# Altium project STM32_Battery_Management_System.PrjPcb (part 1 of 2)
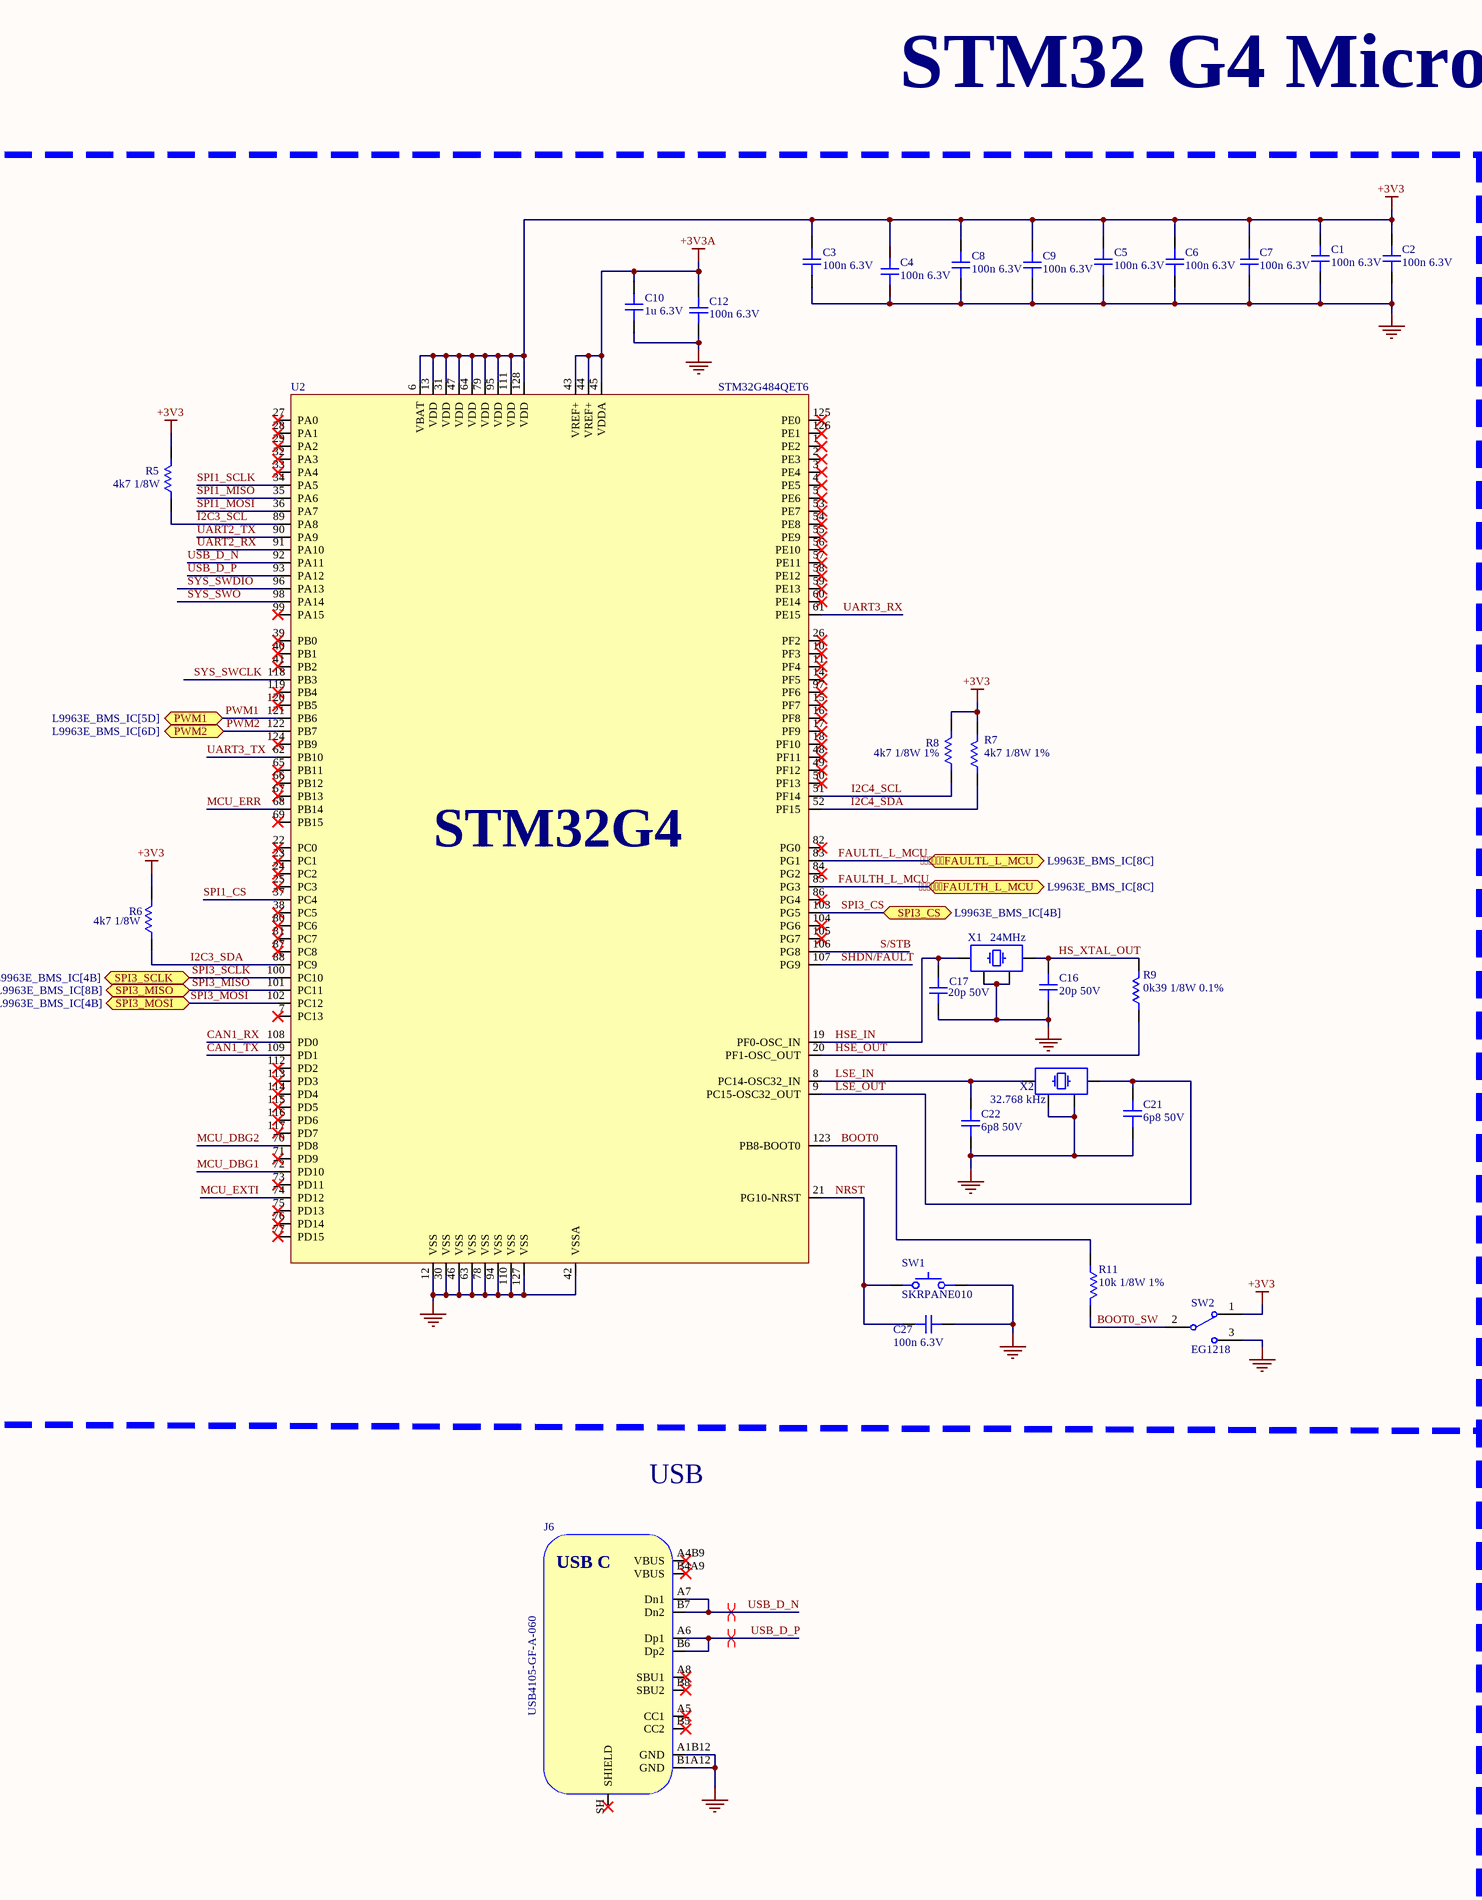
[diagram p0: Microcontroller.SchDoc, left]
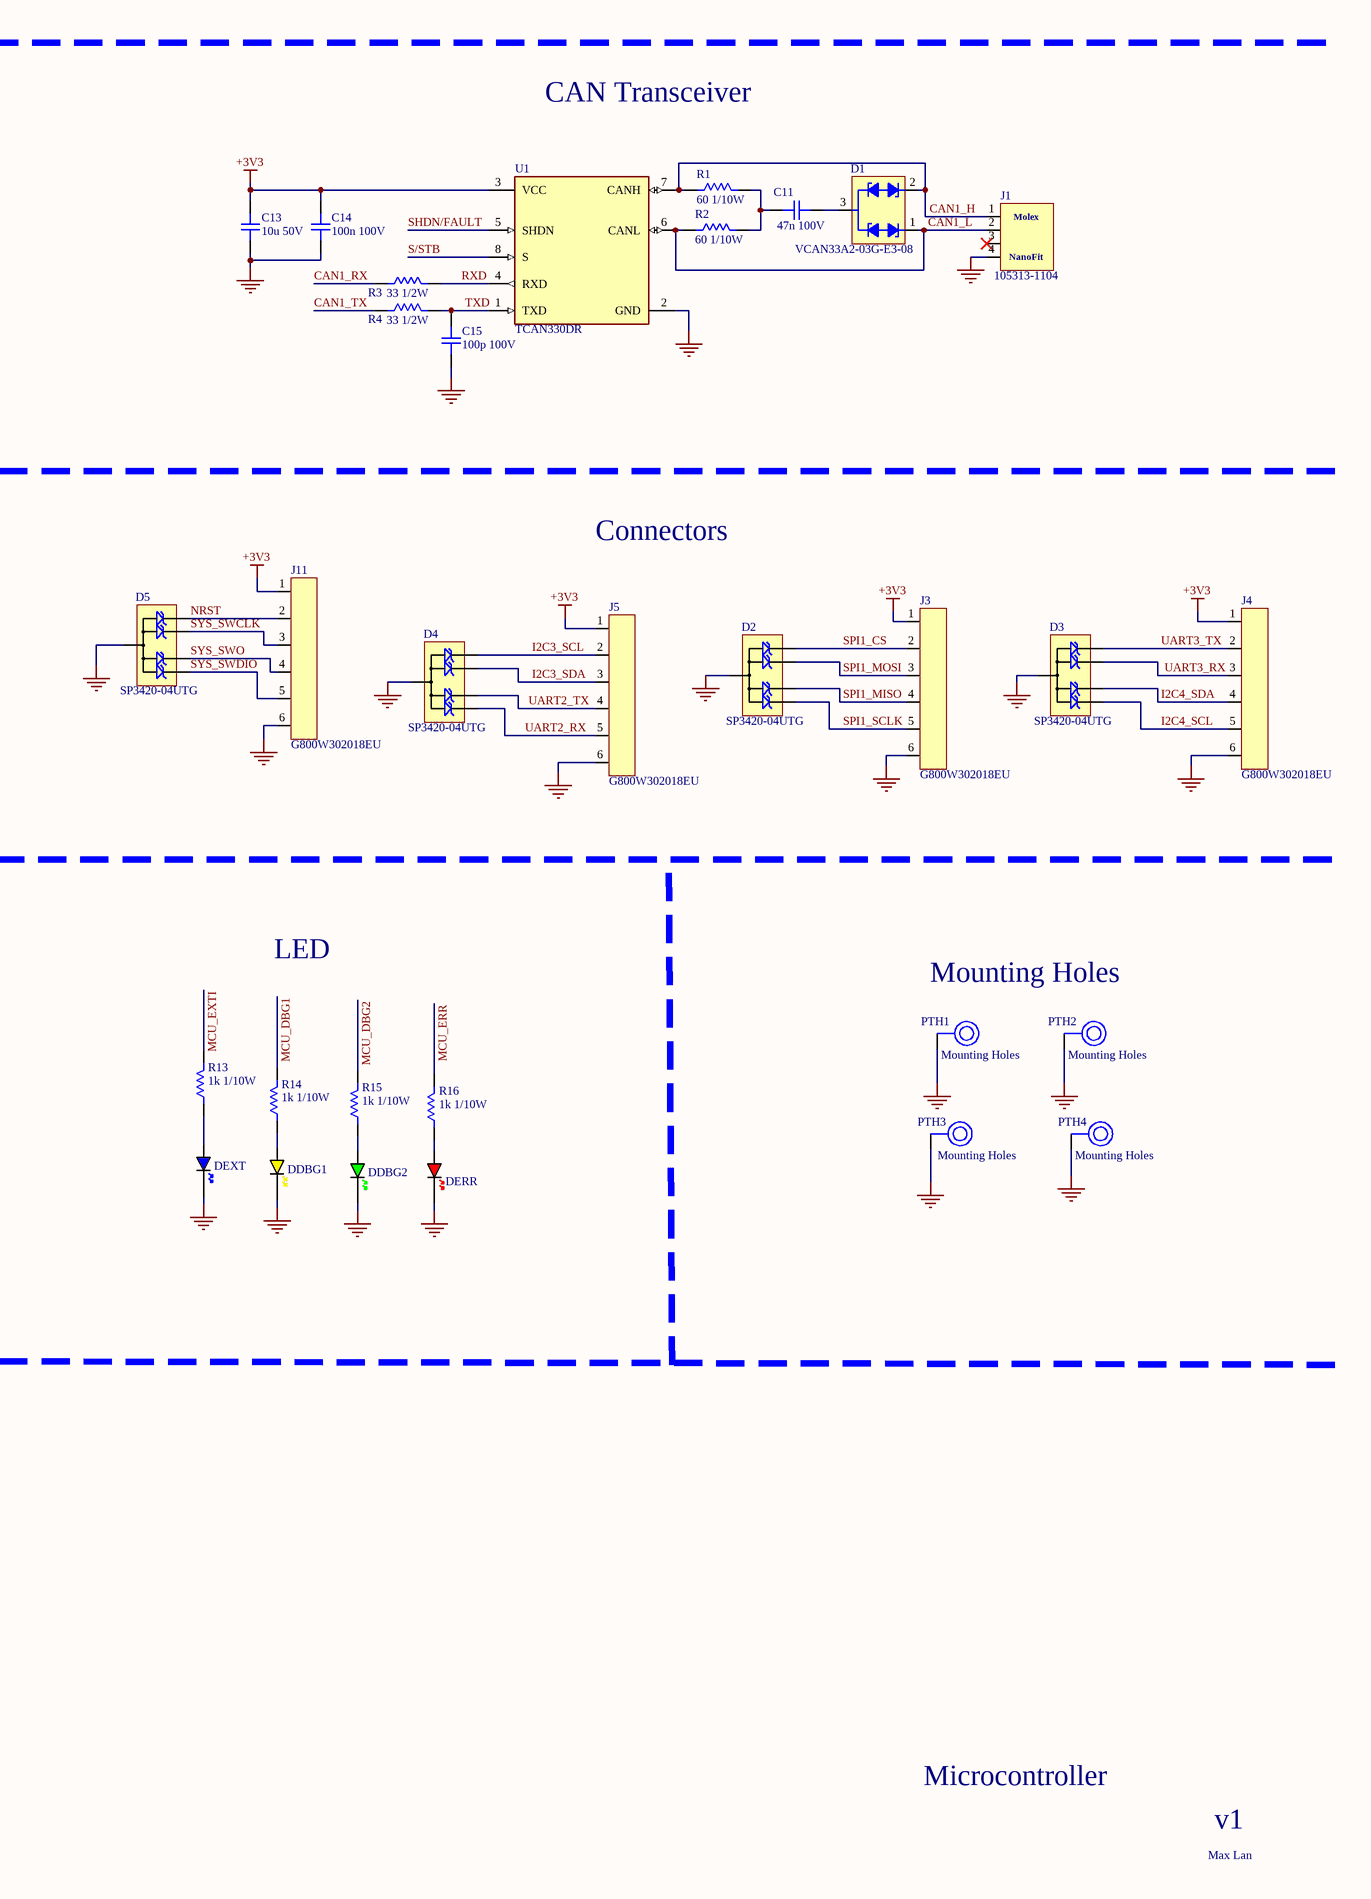
[diagram p1: Microcontroller.SchDoc, right]
4 sheets, 237 parts. Net scope: flat (ports and power ports of the same name join across sheets).
Board file: STM32_Battery_Management_System_V1.PcbDoc
Sheets:
  Microcontroller.SchDoc
  L9963E_BMS_IC.SchDoc
  Power_Management.SchDoc
  TopLevel.SchDoc

## Sheet Microcontroller.SchDoc
size A2; SheetNumber: 1; SheetTotal: 4

### Parts
C1  100n 6.3V  [CAP_0603]
C2  100n 6.3V  [CAP_0603]
C3  100n 6.3V  [CAP_0603]
C4  100n 6.3V  [CAP_0603]
C5  100n 6.3V  [CAP_0603]
C6  100n 6.3V  [CAP_0603]
C7  100n 6.3V  [CAP_0603]
C8  100n 6.3V  [CAP_0603]
C9  100n 6.3V  [CAP_0603]
C10  1u 6.3V  [CAP_0603]
C11  47n 100V  [CAP_0603]
C12  100n 6.3V  [CAP_0603]
C13  10u 50V  [CAP_1210]
C14  100n 100V  [CAP_0603]
C15  100p 100V  [CAP_0603]
C16  20p 50V  [CAP_0603]
C17  20p 50V  [CAP_0603]
C21  6p8 50V  [CAP_0603]
C22  6p8 50V  [CAP_0603]
C27  100n 6.3V  [CAP_0603]
D1  VCAN33A2-03G-E3-08  [VCAN33A2-03G-E3-08]
D2  SP3420-04UTG  [uDFN-10]
D3  SP3420-04UTG  [uDFN-10]
D4  SP3420-04UTG  [uDFN-10]
D5  SP3420-04UTG  [uDFN-10]
DDBG1  YELLOW  [LED_0603_YELLOW]  (value not drawn)
DDBG2  GREEN  [LED_0603_GREEN]  (value not drawn)
DERR  RED  [LED_0603_RED]  (value not drawn)
DEXT  BLUE  [LED_0603_BLUE]  (value not drawn)
J1  105313-1104  [105313-1104]
J3  G800W302018EU  [G800W302018EU]
J4  G800W302018EU  [G800W302018EU]
J5  G800W302018EU  [G800W302018EU]
J6  USB4105-GF-A-060  [USB4105-GF-A-060]
J11  G800W302018EU  [G800W302018EU]
PTH1  Mounting Holes  [Mounting Hole]
PTH2  Mounting Holes  [Mounting Hole]
PTH3  Mounting Holes  [Mounting Hole]
PTH4  Mounting Holes  [Mounting Hole]
R1  60 1/10W  [RES_0201]
R2  60 1/10W  [RES_0201]
R3  33 1/2W  [RES_1206]
R4  33 1/2W  [RES_1206]
R5  4k7 1/8W  [RES_0603]
R6  4k7 1/8W  [RES_0603]
R7  4k7 1/8W 1%  [RES_0603]
R8  4k7 1/8W 1%  [RES_0603]
R9  0k39 1/8W 0.1%  [RES_0603]
R11  10k 1/8W 1%  [RES_0603]
R13  1k 1/10W  [RES_0603]
R14  1k 1/10W  [RES_0603]
R15  1k 1/10W  [RES_0603]
R16  1k 1/10W  [RES_0603]
SW1  SKRPANE010  [SKRPANE010]
SW2  EG1218  [ESWI-EG1218_V]
U1  TCAN330DR  [FP-D0008A-IPC_A]
U2  STM32G484QET6  [LQFP-128]
X1  24MHz  [XTAL_3225]
X2  32.768 kHz  [G43270009]

### Ports
FAULTH_L_MCU (bidir, see L9963E_BMS_IC[8C]), FAULTL_L_MCU (bidir, see L9963E_BMS_IC[8C]), PWM1 (bidir, see L9963E_BMS_IC[5D]), PWM2 (bidir, see L9963E_BMS_IC[6D]), SPI3_CS (bidir, see L9963E_BMS_IC[4B]), SPI3_MISO (bidir, see L9963E_BMS_IC[8B]), SPI3_MOSI (bidir, see L9963E_BMS_IC[4B]), SPI3_SCLK (bidir, see L9963E_BMS_IC[4B])

### Nets
+3V3: C1.2 C2.2 C3.2 C4.2 C5.2 C6.2 C7.2 C8.2 C9.2 C13.2 C14.2 J3.1 J4.1 J5.1 J11.1 R5.2 R6.2 R7.2 R8.2 SW2.1 U1.3(VCC) U2.6(VBAT) U2.13(VDD) U2.31(VDD) U2.47(VDD) U2.64(VDD) U2.79(VDD) U2.95(VDD) U2.111(VDD) U2.128(VDD)
+3V3A: C10.2 C12.2 U2.43(VREF+) U2.44(VREF+) U2.45(VDDA)
GND: C1.1 C2.1 C3.1 C4.1 C5.1 C6.1 C7.1 C8.1 C9.1 C10.1 C12.1 C13.1 C14.1 C15.1 C16.1 C17.1 C21.2 C22.1 C27.1 D2.38(GND) D3.38(GND) D4.38(GND) D5.38(GND) DDBG1.K DDBG2.K DERR.K DEXT.K J1.4 J3.6 J4.6 J5.6 J6.A1B12(GND) J6.B1A12(GND) J11.6 PTH1.1 PTH2.1 PTH3.1 PTH4.1 SW1.34 SW2.3 U1.2(GND) U2.12(VSS) U2.30(VSS) U2.42(VSSA) U2.46(VSS) U2.63(VSS) U2.78(VSS) U2.94(VSS) U2.110(VSS) U2.127(VSS) X1.2 X1.4 X2.2 X2.4
BOOT0: R11.1 U2.123(PB8-BOOT0)
BOOT0_SW: R11.2 SW2.2(COM)
CAN1_H: D1.2 J1.1 R1.1 U1.7(CANH)
CAN1_L: D1.1 J1.2 R2.1 U1.6(CANL)
CAN1_RX: R3.1 U2.108(PD0)
CAN1_TX: R4.1 U2.109(PD1)
FAULTH_L_MCU: U2.85(PG3) ; port FAULTH_L_MCU
FAULTL_L_MCU: U2.83(PG1) ; port FAULTL_L_MCU
HS_XTAL_OUT: C16.2 R9.2 X1.3
HSE_IN: C17.2 U2.19(PF0-OSC_IN) X1.1
HSE_OUT: R9.1 U2.20(PF1-OSC_OUT)
I2C3_SCL: D4.110 J5.2 R5.1 U2.89(PA8)
I2C3_SDA: D4.29 J5.3 R6.1 U2.88(PC9)
I2C4_SCL: D3.56 J4.5 R8.1 U2.51(PF14)
I2C4_SDA: D3.47 J4.4 R7.1 U2.52(PF15)
LSE_IN: C22.2 U2.8(PC14-OSC32_IN) X2.1
LSE_OUT: C21.1 U2.9(PC15-OSC32_OUT) X2.3
MCU_DBG1: R14.2 U2.72(PD10)
MCU_DBG2: R15.2 U2.70(PD8)
MCU_ERR: R16.2 U2.68(PB14)
MCU_EXTI: R13.2 U2.74(PD12)
NRST: C27.2 D5.110 J11.2 SW1.12 U2.21(PG10-NRST)
PWM1: U2.121(PB6) ; port PWM1
PWM2: U2.122(PB7) ; port PWM2
RXD: R3.2 U1.4(RXD)
S/STB: U1.8(S) U2.106(PG8)
SHDN/FAULT: U1.5(SHDN) U2.107(PG9)
SPI1_CS: D2.110 J3.2 U2.37(PC4)
SPI1_MISO: D2.47 J3.4 U2.35(PA6)
SPI1_MOSI: D2.29 J3.3 U2.36(PA7)
SPI1_SCLK: D2.56 J3.5 U2.34(PA5)
SPI3_CS: U2.103(PG5) ; port SPI3_CS
SPI3_MISO: U2.101(PC11) ; port SPI3_MISO
SPI3_MOSI: U2.102(PC12) ; port SPI3_MOSI
SPI3_SCLK: U2.100(PC10) ; port SPI3_SCLK
SYS_SWCLK: D5.29 J11.3 U2.118(PB3)
SYS_SWDIO: D5.56 J11.5 U2.96(PA13)
SYS_SWO: D5.47 J11.4 U2.98(PA14)
TXD: C15.2 R4.2 U1.1(TXD)
UART2_RX: D4.56 J5.5 U2.91(PA10)
UART2_TX: D4.47 J5.4 U2.90(PA9)
UART3_RX: D3.29 J4.3 U2.61(PE15)
UART3_TX: D3.110 J4.2 U2.62(PB10)
USB_D_N: J6.A7(Dn1) J6.B7(Dn2) U2.92(PA11)
USB_D_P: J6.A6(Dp1) J6.B6(Dp2) U2.93(PA12)
NetC11_1: C11.1 R1.2 R2.2
NetC11_2: C11.2 D1.3
NetDDBG1_A: DDBG1.A R14.1
NetDDBG2_A: DDBG2.A R15.1
NetDERR_A: DERR.A R16.1
NetDEXT_A: DEXT.A R13.1

Not connected (* = marked no-connect by the designer): J1 3*; J6 A4B9(VBUS)* A5(CC1)* A8(SBU1)* B4A9(VBUS)* B5(CC2)* B8(SBU2)* SH(SHIELD)*; U2 1(PE2)* 2(PE3)* 3(PE4)* 4(PE5)* 5(PE6)* 7(PC13)* 10(PF3)* 11(PF4)* 14(PF5)* 15(PF7)* 16(PF8)* 17(PF9)* 18(PF10)* 22(PC0)* 23(PC1)* 24(PC2)* 25(PC3)* 26(PF2)* 27(PA0)* 28(PA1)* 29(PA2)* 32(PA3)* 33(PA4)* 38(PC5)* 39(PB0)* 40(PB1)* 41(PB2)* 48(PF11)* 49(PF12)* 50(PF13)* 53(PE7)* 54(PE8)* 55(PE9)* 56(PE10)* 57(PE11)* 58(PE12)* 59(PE13)* 60(PE14)* 65(PB11)* 66(PB12)* 67(PB13)* 69(PB15)* 71(PD9)* 73(PD11)* 75(PD13)* 76(PD14)* 77(PD15)* 80(PC6)* 81(PC7)* 82(PG0)* 84(PG2)* 86(PG4)* 87(PC8)* 97(PF6)* 99(PA15)* 104(PG6)* 105(PG7)* 112(PD2)* 113(PD3)* 114(PD4)* 115(PD5)* 116(PD6)* 117(PD7)* 119(PB4)* 120(PB5)* 124(PB9)* 125(PE0)* 126(PE1)*

### Layout directives
differential pair; differential pair class USB_DIFF_PAIR: USB_D_N, USB_D_P

### Notes on the sheet
- STM32 G4 Microcontroller
- CAN Transceiver
- Connectors
- LED
- Mounting Holes
- USB
- Microcontroller
- Max Lan
- v1
- (in symbol 105313-1104) NanoFit
- (in symbol STM32G484QET6) STM32G4
- (in symbol USB4105-GF-A-060) USB C

### Library data of the parts
C1-C9 C12 C27 = KGM15AR70J104KT: Multilayer Ceramic Capacitors MLCC - SMD/SMT 6.3V .1uF X7R 0603 10%; Manufacturer: KYOCERA AVX; Rating: 100n 6.3V 100n 0603; Manufacturer Part Number: KGM15AR70J104KT; Distributor Link: https://ele.kyocera.com/assets/products/capacitor/KGM_Series_e.pdf; LCSC: N/A; Dielectric: *
C10 = C0603X105K9RACAUTO: Multilayer Ceramic Capacitors MLCC - SMD/SMT 6.3 Vo 1 uF 0603 X7R 10 % AECQ200; Manufacturer: KEMET; Rating: 1u 6.3V X7R 0603; Manufacturer Part Number: C0603X105K9RACAUTO; Distributor Link: https://www.mouser.tw/datasheet/3/72/1/C0603X105K9RACAUTO.pdf; LCSC: N/A; Dielectric: *
C11 = C0603C473J1RACTU: Multilayer Ceramic Capacitors MLCC - SMD/SMT 100V 0.047uF X7R 0603 5%; Manufacturer: KEMET; Rating: 47nF 100V X7R 0603 5%; Manufacturer Part Number: C0603C473J1RACTU; Distributor Link: https://www.mouser.tw/en/ProductDetail/KEMET/C0603C473J1RACTU?qs=sGAEpiMZZMvsSlwiRhF8qpRMYGxmftL79YZ310PzB5U%3D; Datasheet Link: https://www.mouser.tw/datasheet/3/72/1/C0603C473J1RACTU.pdf; Dielectric: *
C13 = KAF32LR71H106KL: Multilayer Ceramic Capacitors MLCC - SMD/SMT 50V 10uF X7R 1210 10 % AEC-Q200 FLEXITERM; Manufacturer: KYOCERA AVX; Rating: 10uF 50V 1210 X7R 10%; Manufacturer Part Number: KAF32LR71H106KL; Distributor Link: https://www.mouser.tw/en/ProductDetail/KYOCERA-AVX/KAF32LR71H106KL?qs=sGAEpiMZZMsh%252B1woXyUXj17cMikWvs6%2F%252Bex2HAbQHVc%3D; Datasheet Link: https://www.mouser.tw/datasheet/3/5926/1/AutoMLCCKAF.pdf; Dielectric: *
C14 = MAJCH168BB7104KTEA01: Multilayer Ceramic Capacitors MLCC - SMD/SMT 100V 0.1uF 0603 X7R 10% AECQ2; Manufacturer: TAIYO YUDEN; Rating: 100nF 100V X7R 0603 10%; Manufacturer Part Number: MAJCH168BB7104KTEA01; Distributor Link: https://www.mouser.tw/en/ProductDetail/TAIYO-YUDEN/MAJCH168BB7104KTEA01?qs=ZcfC38r4PovaTBrG0IdezQ%3D%3D; Datasheet Link: https://www.mouser.com/catalog/specsheets/TAIYO_YUDEN_03-08-2024_MAJCH168BB7104KTEA01_SS.pdf?_gl=1*17qbpp1*_gcl_aw*R0NMLjE3ODUyMjg2NDkuQ2p3S0NBandwcUhUQmhBY0Vpd0FqMkFmdXJYOV9OUy1CV0xFSmd6T0FaYy1HZXR1bHVfaUZmaHVzRkI2bHhkODVUMjVSNlJWbnBOUkFob0NEdHNRQXZEX0J3RQ..*_gcl_au*MTM0NzYwMzc0Mi4xNzgyNDQ3MDMwLjE4MDQ0Nzg2ODUuMTc4NTI5MDg4OS4xNzg1MjkxOTE2LjE1NDk0Mzk5MTcuMTc4NTIxODYwOC4xNzg1MjkxOTE2*_ga*MTg5NTU5OTIyLjE3ODI0NDcwMzM.*_ga_15W4STQT4T*czE3ODUyODM3NTgkbzk5JGcxJHQxNzg1MjkxOTI1JGo0MiRsMCRoMA..; Dielectric: *
C15 = KGM15AR72A101JT: Multilayer Ceramic Capacitors MLCC - SMD/SMT 100V 100pF X7R 0603 5%; Manufacturer: KYOCERA AVX; Rating: 100pF 100V X7R 0603 5%; Manufacturer Part Number: KGM15AR72A101JT; Distributor Link: https://ele.kyocera.com/assets/products/capacitor/KGM_Series_e.pdf; Datasheet Link: https://www.mouser.tw/en/ProductDetail/KYOCERA-AVX/KGM15AR72A101JT?qs=sGAEpiMZZMvsSlwiRhF8qrQG6leidpLjMVa2%2F5XxVbDE2R%2F9vaQftg%3D%3D; Dielectric: *
C16 C17 = C0603C200J5RACTU: Multilayer Ceramic Capacitors MLCC - SMD/SMT 50V 20pF 5% X7R 0603; Manufacturer: KEMET; Rating: 20p 50V X7R 0603; Manufacturer Part Number: Multilayer Ceramic Capacitors MLCC - SMD/SMT 50V 20pF 5% X7R 0603; Distributor Link: https://www.mouser.tw/datasheet/3/72/1/KEM_C1002_X7R_SMD.pdf; LCSC: N/A; Dielectric: *
C21 C22 = 06035C6R8KAT2A: Multilayer Ceramic Capacitors MLCC - SMD/SMT T101 COMMERCIAL; Manufacturer: KYOCERA AVX; Rating: 6.8pF 50VDC X7R 10% 0603; Manufacturer Part Number: 06035C6R8KAT2A; Distributor Link: https://www.mouser.tw/datasheet/3/5926/1/X7RDielectric.pdf; LCSC: N/A; Dielectric: *
D1 = VCAN33A2-03G-E3-08: ESD Protection Diodes / TVS Diodes 9.5pF 33V SOT-323; Manufacturer Name: Vishay Semicondutors; ComponentLink1Description: Datasheet Link; ComponentLink1URL: https://www.vishay.com/doc?86152; ComponentLink2Description: Distributor Link; ComponentLink2URL: https://www.mouser.tw/en/ProductDetail/Vishay-Semiconductors/VCAN33A2-03G-E3-08?qs=wnTfsH77Xs51hWQib6XZOg%3D%3D; Ratings: 9.5pF 33V
D2-D5 = SP3420-04UTG: TVS Diode Array Low Capacitance ESD Protection 4-Channel (Vwork=3V3, Vclamp=6V); Manufacturer: Littelfuse; Manufacturer Part Number: SP3420-04UTG
DDBG1 = LED_0603_YELLOW: LED 0603 YELLOW SMD
DDBG2 = LED_0603_GREEN: LED 0603 GREEN SMD
DERR = LED_0603_RED: LED 0603 RED SMD
DEXT = LED_0603_BLUE: LED 0603 BLUE SMD
J1 = 105313-1104: Nano-Fit Right-Angle Header, Through Hole, 2.50mm Pitch, Single Row, 2 Circuits, Tin (Sn) Plating, Black, Glow-Wire Capable, Tray; Manufacturer: Molex; Manufacturer Part Number: 105313-1104
J3-J5 J11 = G800W302018EU: Pin Header 6 Position 2.54mm Pitch; Manufacturer: Amphenol; Manufacturer Part Number: G800W302018EU
J6 = USB4105-GF-A-060: USB Connector Type C SMT 12 Pin; Manufacturer: GCT; Manufacturer Part Number: USB4105-GF-A-060; Distributor Link: https://eu.mouser.com/ProductDetail/GCT/USB4105-GF-A-060?qs=QNEnbhJQKvY2mocwNJzgfA%3D%3D
PTH1-PTH4 = Mounting Holes: I'm so sick of having to manually make these everytime with a different size, and how in the world do do I make one like Phil's Lab with Gnd vias around it?
R1 R2 = RK73H1HRTTCM60R4F: Thick Film Resistors - SMD; Manufacturer: KOA Speer; Values: 60ohm 1/10W 1% 0201; Manufacturer Part Number: RK73H1HRTTCM60R4F; Distributor Link: https://www.mouser.tw/en/ProductDetail/KOA-Speer/RK73H1HRTTCM60R4F?qs=sGAEpiMZZMvdGkrng054t2cqbZCzJY7NpUeVphkOANR%252BH8AfE6cgtQ%3D%3D; Datasheet Link: https://www.koaspeer.com/pdfs/RK73-RT.pdf
R3 R4 = SR1206FR-7W33RL: Thick Film Resistors - SMD 33 Ohms 1/2 W 1206 1 % AEC-Q200; Manufacturer: YAGEO; Values: 33ohm 1/2W 1205 1%; Manufacturer Part Number: SR1206FR-7W33RL; Distributor Link: https://www.mouser.tw/en/ProductDetail/YAGEO/SR1206FR-7W33RL?qs=1mbolxNpo8dtzpgXLPcQnA%3D%3D; Datasheet Link: https://www.mouser.tw/datasheet/3/508/1/PYu-SR_20105_RoHS_L_12.pdf
R5-R8 = CRCW06034K70FKEA: Thick Film Resistors - SMD 1/8 Watt 4.7Kohms 1%; Manufacturer: Vishay; Values: 4.7k 1% 1/8W 0603; Manufacturer Part Number: CRCW06034K70FKEA; Distributor Link: https://www.vishay.com/docs/20035/dcrcwe3.pdf
R9 = ERA-3VEB3900V: Thin Film Resistors - SMD 0603 0.1% 390ohm 25ppm SMD; Manufacturer: Panasonic; Ratings: 390ohm 0603 0.1% 1/8W; Manufacturer Part Number: ERA-3VEB3900V; Distributor Link: https://industrial.panasonic.com/cdbs/www-data/pdf/RDM0000/RDM0000C331.pdf; LCSC: N/A
R11 = CRCW060310K0FKEI: Thick Film Resistors - SMD 10K OHM 1%; Manufacturer: Vishay; Value: 10k 1% 1/8W 0603; Manufacturer Part Number: CRCW060310K0FKEI; Distributor Link: https://www.vishay.com/docs/20035/dcrcwe3.pdf
R13-R16 = CR0603-FX-1001EPF: Thick Film Resistors - SMD Res 0603 1k 1% 100mW TC100 low lead; Manufacturer: Bourns; Values: 1k 1% 1/10W 0603; Manufacturer Part Number: CR0603-FX-1001EPF; Distributor Link: https://www.mouser.tw/en/ProductDetail/Bourns/CR0603-FX-1001EPF?qs=sGAEpiMZZMvdGkrng054t2cqbZCzJY7NyLPI0qsjVVoXr8t57oNyzw%3D%3D; Datasheet Link: https://www.mouser.tw/datasheet/3/40/1/CR-PF.pdf
SW1 = SKRPANE010: Tactile Switch SMD SPST; Manufacturer: Alps Alpine; Manufacturer Part Number: SKRPANE010
SW2 = CMP-1696-00002-1: Slide Switch, 500 V, -20 to 70 degC, 3-Pin THD, RoHS; Case\Package: SOT-23-5; Output Current: 150 mA; Nominal Output Voltage: 3.3 V; Max Power Dissipation: 250 mW; Min Input Voltage: 4.3 V; Outputs: 1; Max Input Voltage: 8 V; Dropout Voltage: 300 mV; PackageDescription: 3-Pin Through Hole Device, Body 11.6 x 4 mm, Pitch 2.5 mm; ComponentLink1URL: http://www.e-switch.ch/en/; RoHSCompliant: true; Length: 3 mm; ComponentLink1Description: Manufacturer URL; Power Rating: 250 mW; Mount: Surface Mount; Max Operating Temperature: 85 degC; REACH SVHC: No SVHC; Radiation Hardening: No; Height: 1.3 mm; Pins: 5; Max Ouput Current: 150 mA; Output Voltage: 3.3 V; Width: 1.8 mm; Package Quantity: 3000; ComponentLink2URL: https://www.e-switch.com/system/asset/product_line/data_sheet/119/EG.pdf; Min Operating Temperature: -40 degC; ComponentLink2Description: Datasheet; DatasheetVersion: Oct-15; PackageReference: EG1218; Packaging: Tape and Reel
U1 = CMP-04872-000104-1: IC TRANSCEIVER 1/1 8SOIC; Data Rate: 1Mbps; RoHS Compliant: Yes; Case/Package: SOIC; Mount: Surface Mount; Number of Pins: 8; Packaging: Cut Tape; Max Operating Temperature: 125°C; Lead Free: Lead Free; Min Operating Temperature: -40°C
U2 = STM32G484QET6: STM32G4 Microcontroller LQFP-128 170 MHz 107 I/O; Manufacturer: STMicroelectronics; Manufacturer Part Number: STM32G484QET6
X1 = TSX-3225_24.0000MF15X-AC: Crystal SMD 24MHz 10PPM 7pF 3225; Manufacturer: Epson; Manufacturer Part Number: TSX-3225 24.0000MF15X-AC
X2 = G43270009: Crystals Crystal Plastic SMD8038 T&R 3K. / 32.768 kHz; Load Capacitance: 8pF; Tolerance: 10 PPM; Distributor Link: *; Frequency: 32.768 kHz

## Sheet L9963E_BMS_IC.SchDoc
size A2; SheetNumber: 2; SheetTotal: 4
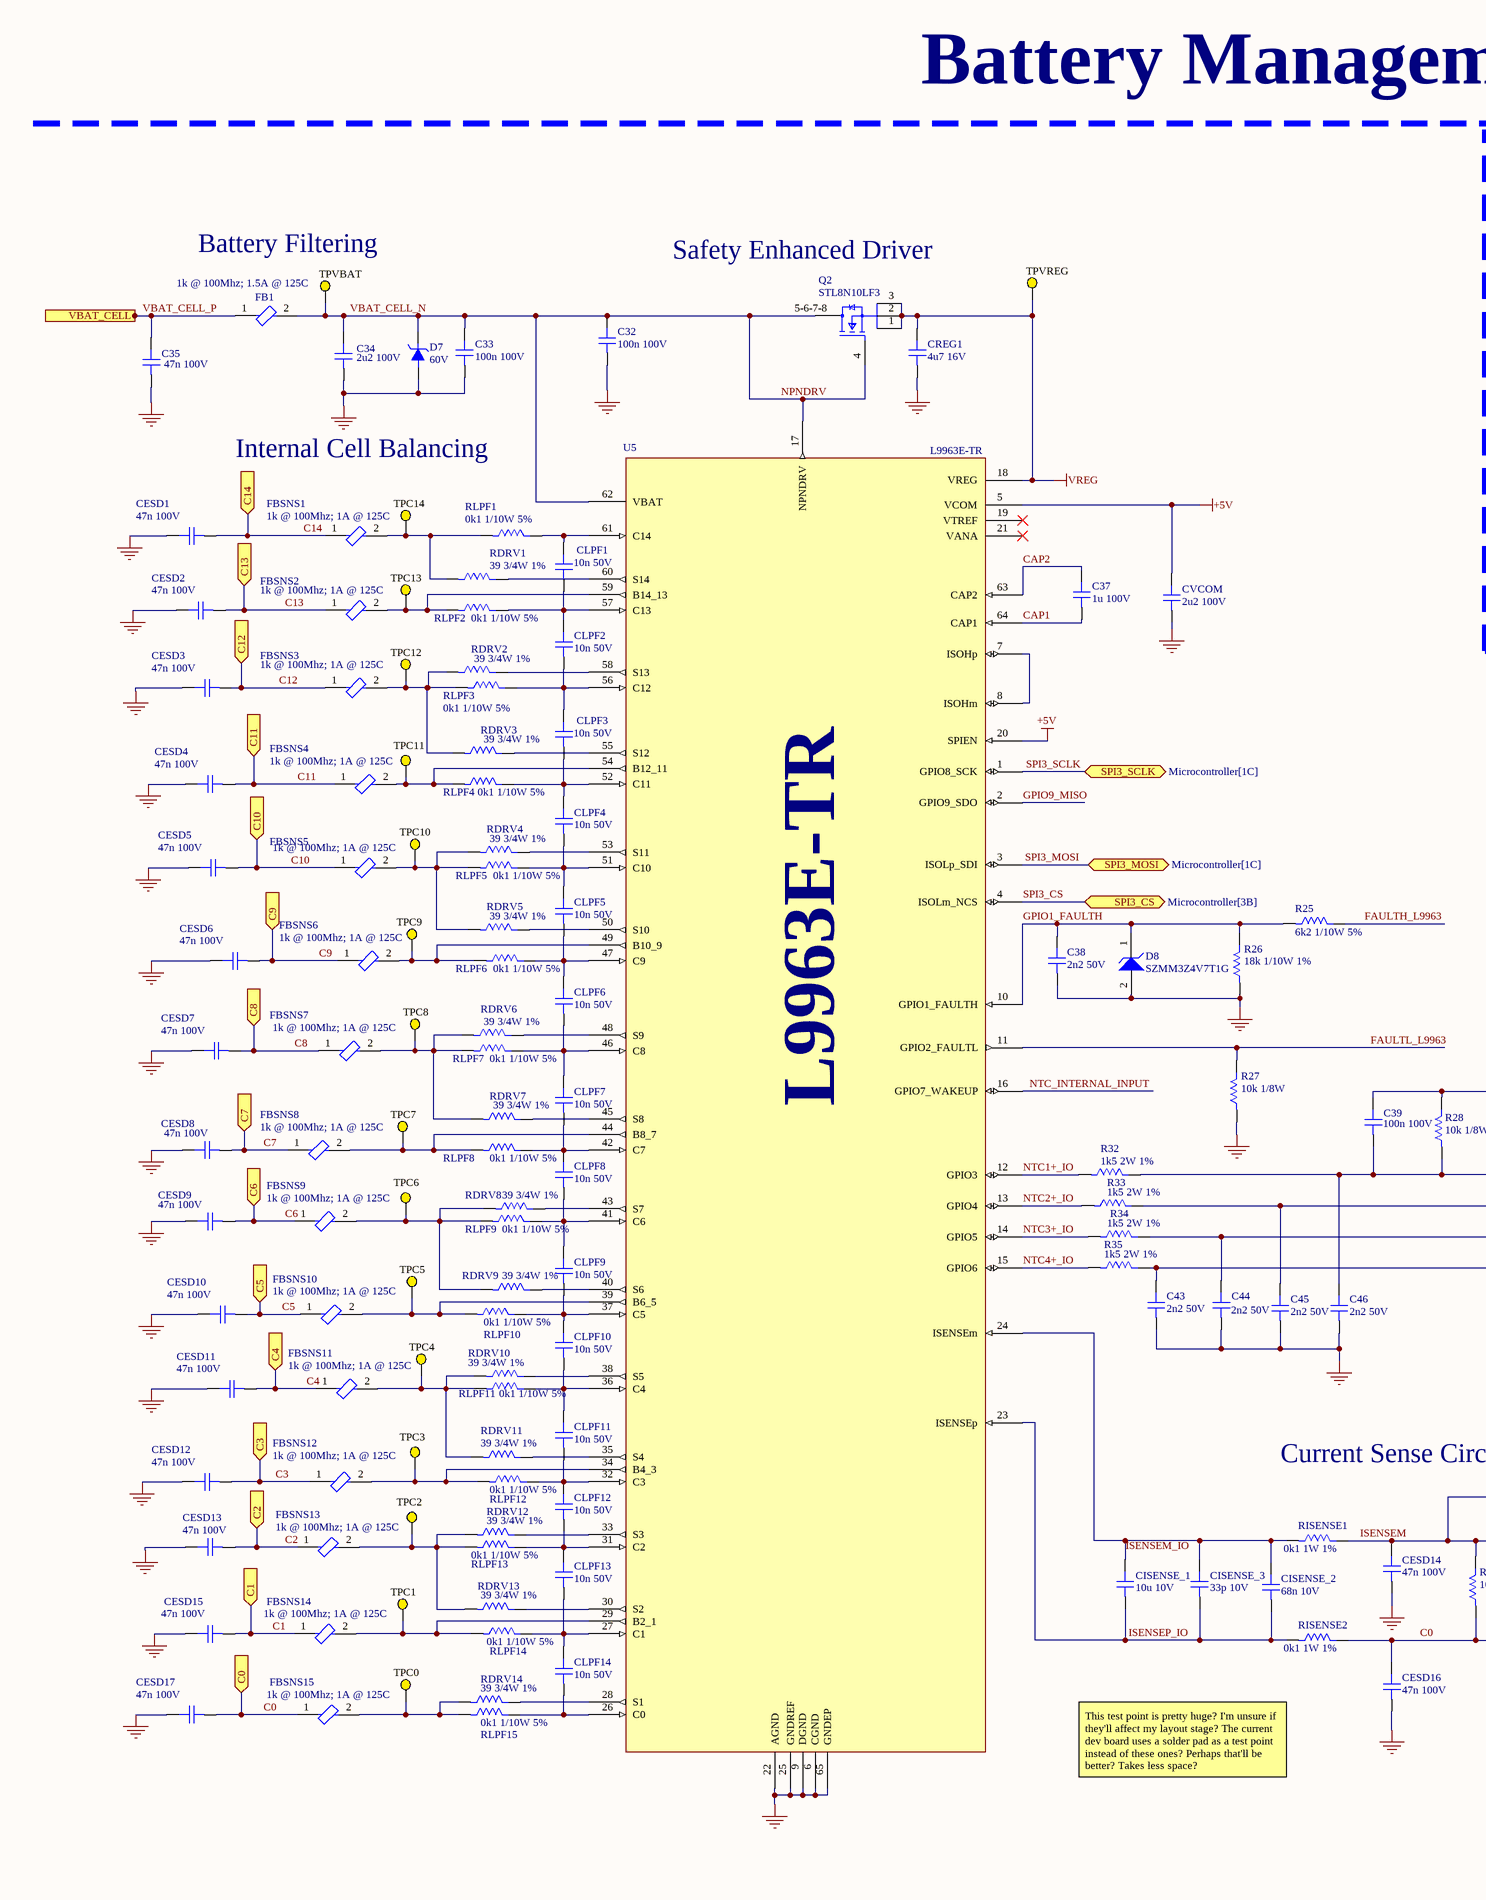
[diagram p2: L9963E_BMS_IC.SchDoc, left]
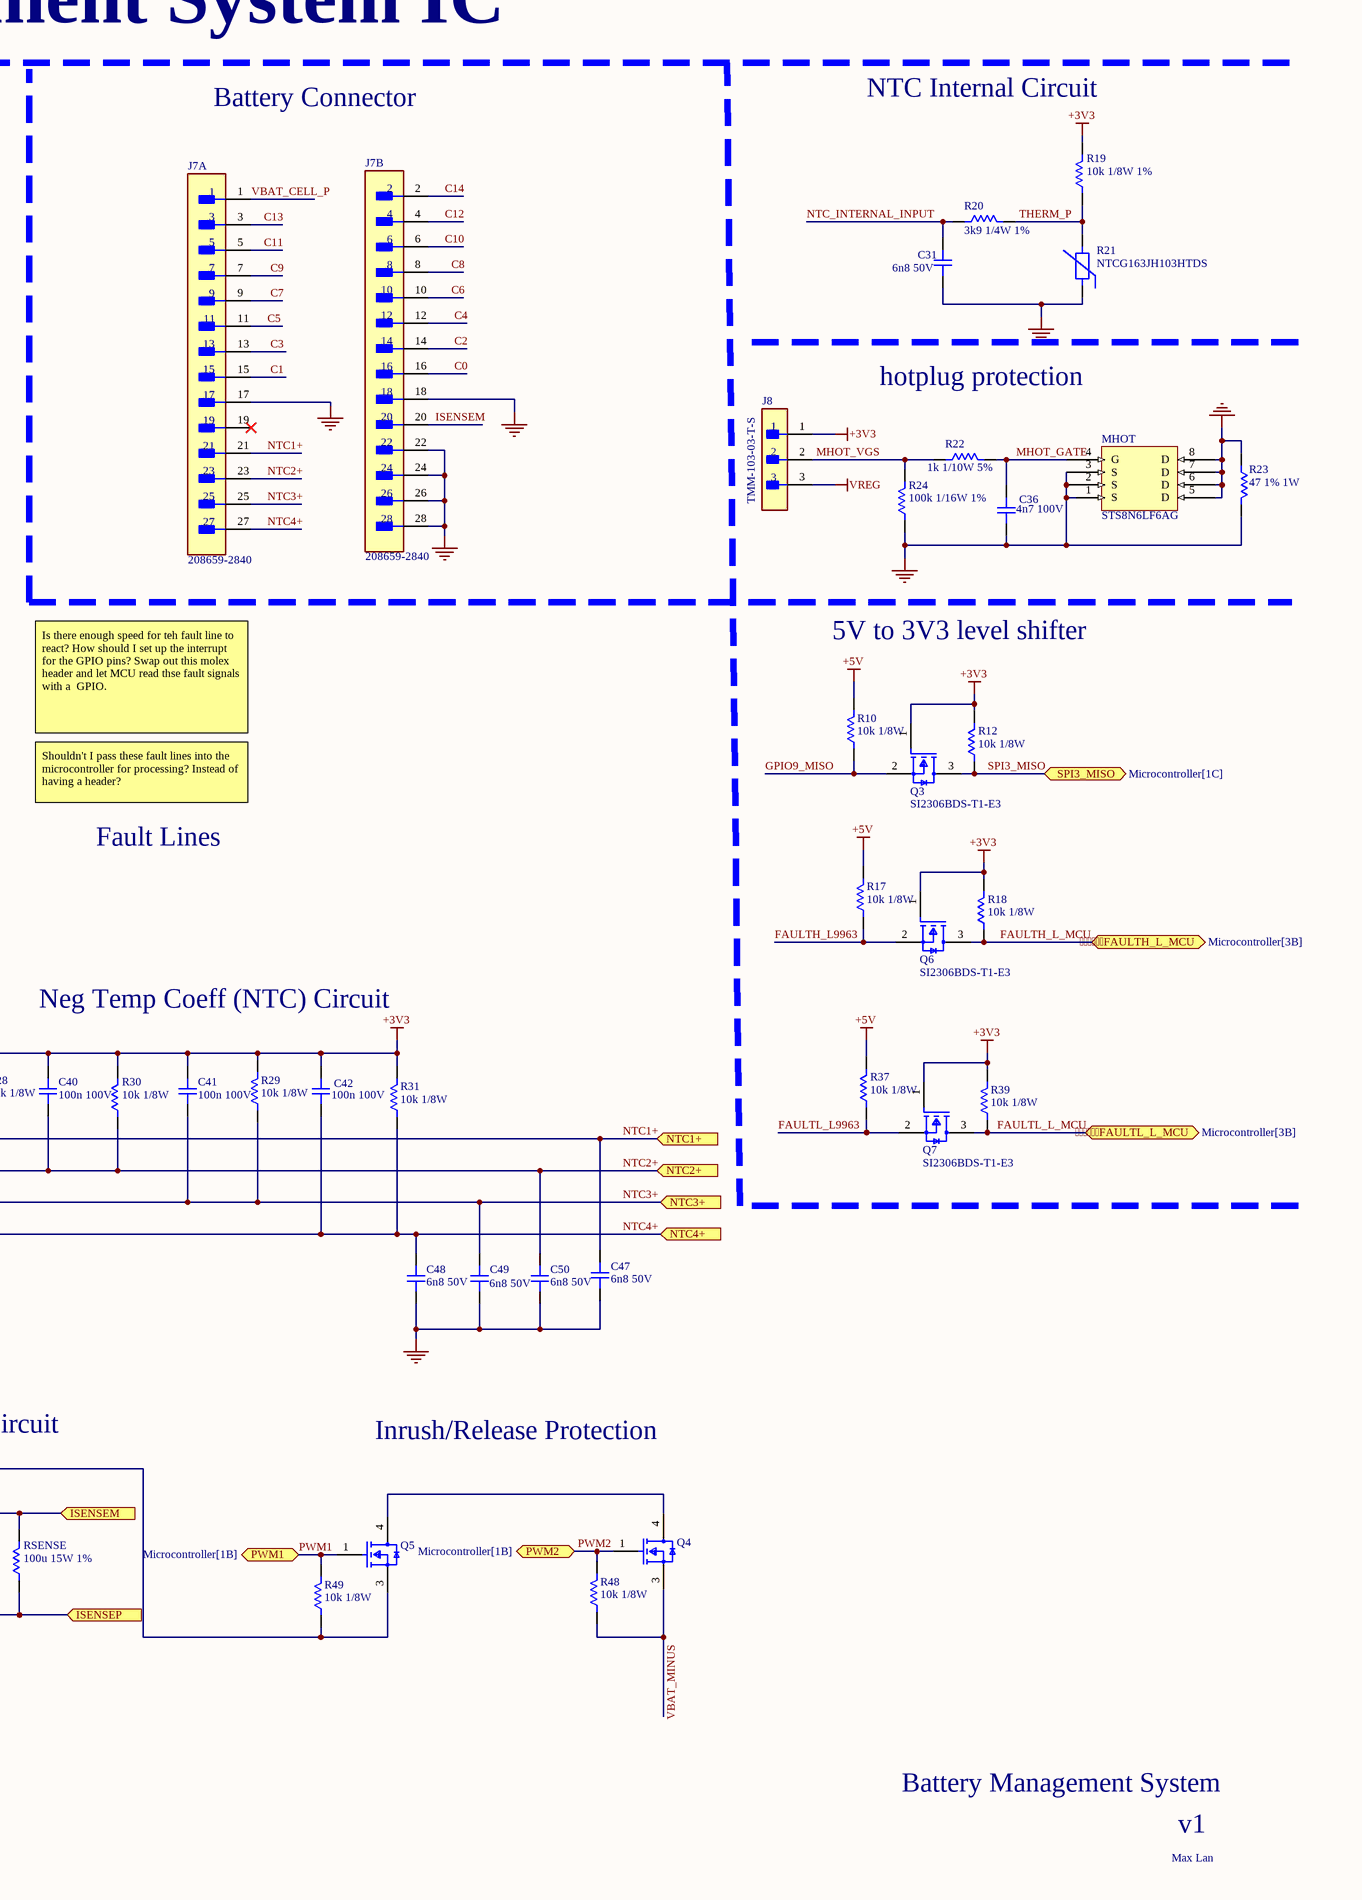
[diagram p3: L9963E_BMS_IC.SchDoc, right]

### Parts
C31  6n8 50V  [CAP_0603]
C32  100n 100V  [CAP_0603]
C33  100n 100V  [CAP_0603]
C34  2u2 100V  [CAP_1210]
C35  47n 100V  [CAP_0603]
C36  4n7 100V  [CAP_0603]
C37  1u 100V  [CAP_0603]
C38  2n2 50V  [CAP_0603]
C39  100n 100V  [CAP_0603]
C40  100n 100V  [CAP_0603]
C41  100n 100V  [CAP_0603]
C42  100n 100V  [CAP_0603]
C43  2n2 50V  [CAP_0603]
C44  2n2 50V  [CAP_0603]
C45  2n2 50V  [CAP_0603]
C46  2n2 50V  [CAP_0603]
C47  6n8 50V  [CAP_0603]
C48  6n8 50V  [CAP_0603]
C49  6n8 50V  [CAP_0603]
C50  6n8 50V  [CAP_0603]
CESD1  47n 100V  [CAP_0603]
CESD2  47n 100V  [CAP_0603]
CESD3  47n 100V  [CAP_0603]
CESD4  47n 100V  [CAP_0603]
CESD5  47n 100V  [CAP_0603]
CESD6  47n 100V  [CAP_0603]
CESD7  47n 100V  [CAP_0603]
CESD8  47n 100V  [CAP_0603]
CESD9  47n 100V  [CAP_0603]
CESD10  47n 100V  [CAP_0603]
CESD11  47n 100V  [CAP_0603]
CESD12  47n 100V  [CAP_0603]
CESD13  47n 100V  [CAP_0603]
CESD14  47n 100V  [CAP_0603]
CESD15  47n 100V  [CAP_0603]
CESD16  47n 100V  [CAP_0603]
CESD17  47n 100V  [CAP_0603]
CISENSE_1  10u 10V  [CAP_0603]
CISENSE_2  68n 10V  [CAP_0603]
CISENSE_3  33p 10V  [CAP_0402]
CLPF1  10n 50V  [CAP_0603]
CLPF2  10n 50V  [CAP_0603]
CLPF3  10n 50V  [CAP_0603]
CLPF4  10n 50V  [CAP_0603]
CLPF5  10n 50V  [CAP_0603]
CLPF6  10n 50V  [CAP_0603]
CLPF7  10n 50V  [CAP_0603]
CLPF8  10n 50V  [CAP_0603]
CLPF9  10n 50V  [CAP_0603]
CLPF10  10n 50V  [CAP_0603]
CLPF11  10n 50V  [CAP_0603]
CLPF12  10n 50V  [CAP_0603]
CLPF13  10n 50V  [CAP_0603]
CLPF14  10n 50V  [CAP_0603]
CREG1  4u7 16V  [CAP_0805]
CVCOM  2u2 100V  [CAP_1210]
D7  60V  [5.0SMDJ60A]
D8  SZMM3Z4V7T1G  [ONSC-SOD-323-2-477-02_V]
FB1  1k @ 100Mhz; 1.5A @ 125C  [FP-MPZ2012-MFG]
FBSNS1  1k @ 100Mhz; 1A @ 125C  [FP-MPZ2012-MFG]
FBSNS2  1k @ 100Mhz; 1A @ 125C  [FP-MPZ2012-MFG]
FBSNS3  1k @ 100Mhz; 1A @ 125C  [FP-MPZ2012-MFG]
FBSNS4  1k @ 100Mhz; 1A @ 125C  [FP-MPZ2012-MFG]
FBSNS5  1k @ 100Mhz; 1A @ 125C  [FP-MPZ2012-MFG]
FBSNS6  1k @ 100Mhz; 1A @ 125C  [FP-MPZ2012-MFG]
FBSNS7  1k @ 100Mhz; 1A @ 125C  [FP-MPZ2012-MFG]
FBSNS8  1k @ 100Mhz; 1A @ 125C  [FP-MPZ2012-MFG]
FBSNS9  1k @ 100Mhz; 1A @ 125C  [FP-MPZ2012-MFG]
FBSNS10  1k @ 100Mhz; 1A @ 125C  [FP-MPZ2012-MFG]
FBSNS11  1k @ 100Mhz; 1A @ 125C  [FP-MPZ2012-MFG]
FBSNS12  1k @ 100Mhz; 1A @ 125C  [FP-MPZ2012-MFG]
FBSNS13  1k @ 100Mhz; 1A @ 125C  [FP-MPZ2012-MFG]
FBSNS14  1k @ 100Mhz; 1A @ 125C  [FP-MPZ2012-MFG]
FBSNS15  1k @ 100Mhz; 1A @ 125C  [FP-MPZ2012-MFG]
J7  208659-2840  [FP-208659-2840-MFG]  (parts A,B of 2)
J8  TMM-103-03-T-S  [FP-TMM-103-03-T-S-MFG]
MHOT  STS8N6LF6AG  [STS8N6LF6AG]
Q2  STL8N10LF3  [FP-PowerFLAT5x6-A0Y5_8231-MFG]
Q3  SI2306BDS-T1-E3  [FP-S-03946-IPC_A]
Q4  HUF76629D3ST  [FP-369AS-MFG]  (value not drawn)
Q5  HUF76629D3ST  [FP-369AS-MFG]  (value not drawn)
Q6  SI2306BDS-T1-E3  [FP-S-03946-IPC_A]
Q7  SI2306BDS-T1-E3  [FP-S-03946-IPC_A]
R10  10k 1/8W  [RES_0603]
R12  10k 1/8W  [RES_0603]
R17  10k 1/8W  [RES_0603]
R18  10k 1/8W  [RES_0603]
R19  10k 1/8W 1%  [RES_0603]
R20  3k9 1/4W 1%  [RES_0805]
R21  NTCG163JH103HTDS  [RES_0603]
R22  1k 1/10W 5%  [RES_0603]
R23  47 1% 1W  [RES_2512]
R24  100k 1/16W 1%  [RES_0402]
R25  6k2 1/10W 5%  [RES_0603]
R26  18k 1/10W 1%  [RES_0603]
R27  10k 1/8W  [RES_0603]
R28  10k 1/8W  [RES_0603]
R29  10k 1/8W  [RES_0603]
R30  10k 1/8W  [RES_0603]
R31  10k 1/8W  [RES_0603]
R32  1k5 2W 1%  [RES_2010]
R33  1k5 2W 1%  [RES_2010]
R34  1k5 2W 1%  [RES_2010]
R35  1k5 2W 1%  [RES_2010]
R37  10k 1/8W  [RES_0603]
R39  10k 1/8W  [RES_0603]
R48  10k 1/8W  [RES_0603]
R49  10k 1/8W  [RES_0603]
RDRV1  39 3/4W 1%  [RES_0603]
RDRV2  39 3/4W 1%  [RES_0603]
RDRV3  39 3/4W 1%  [RES_0603]
RDRV4  39 3/4W 1%  [RES_0603]
RDRV5  39 3/4W 1%  [RES_0603]
RDRV6  39 3/4W 1%  [RES_0603]
RDRV7  39 3/4W 1%  [RES_0603]
RDRV8  39 3/4W 1%  [RES_0603]
RDRV9  39 3/4W 1%  [RES_0603]
RDRV10  39 3/4W 1%  [RES_0603]
RDRV11  39 3/4W 1%  [RES_0603]
RDRV12  39 3/4W 1%  [RES_0603]
RDRV13  39 3/4W 1%  [RES_0603]
RDRV14  39 3/4W 1%  [RES_0603]
RISENSE1  0k1 1W 1%  [RES_2010]
RISENSE2  0k1 1W 1%  [RES_2010]
RLPF1  0k1 1/10W 5%  [RES_0603]
RLPF2  0k1 1/10W 5%  [RES_0603]
RLPF3  0k1 1/10W 5%  [RES_0603]
RLPF4  0k1 1/10W 5%  [RES_0603]
RLPF5  0k1 1/10W 5%  [RES_0603]
RLPF6  0k1 1/10W 5%  [RES_0603]
RLPF7  0k1 1/10W 5%  [RES_0603]
RLPF8  0k1 1/10W 5%  [RES_0603]
RLPF9  0k1 1/10W 5%  [RES_0603]
RLPF10  0k1 1/10W 5%  [RES_0603]
RLPF11  0k1 1/10W 5%  [RES_0603]
RLPF12  0k1 1/10W 5%  [RES_0603]
RLPF13  0k1 1/10W 5%  [RES_0603]
RLPF14  0k1 1/10W 5%  [RES_0603]
RLPF15  0k1 1/10W 5%  [RES_0603]
RSENSE  100u 15W 1%  [RES_5931]
TPC0  5014  [KSTN-5014_V]  (value not drawn)
TPC1  5014  [KSTN-5014_V]  (value not drawn)
TPC2  5014  [KSTN-5014_V]  (value not drawn)
TPC3  5014  [KSTN-5014_V]  (value not drawn)
TPC4  5014  [KSTN-5014_V]  (value not drawn)
TPC5  5014  [KSTN-5014_V]  (value not drawn)
TPC6  5014  [KSTN-5014_V]  (value not drawn)
TPC7  5014  [KSTN-5014_V]  (value not drawn)
TPC8  5014  [KSTN-5014_V]  (value not drawn)
TPC9  5014  [KSTN-5014_V]  (value not drawn)
TPC10  5014  [KSTN-5014_V]  (value not drawn)
TPC11  5014  [KSTN-5014_V]  (value not drawn)
TPC12  5014  [KSTN-5014_V]  (value not drawn)
TPC13  5014  [KSTN-5014_V]  (value not drawn)
TPC14  5014  [KSTN-5014_V]  (value not drawn)
TPVBAT  5014  [KSTN-5014_V]  (value not drawn)
TPVREG  5014  [KSTN-5014_V]  (value not drawn)
U5  L9963E-TR  [L9963E-TR]

### Ports
FAULTH_L_MCU (bidir, see Microcontroller[3B]), FAULTL_L_MCU (bidir, see Microcontroller[3B]), C0 (in), C1 (in), C2 (in), C3 (in), C4 (in), C5 (in), C6 (in), C7 (in), C8 (in), C9 (in), C10 (in), C11 (in), C12 (in), C13 (in), C14 (in), ISENSEM (in), ISENSEP (in), NTC1+ (in), NTC2+ (in), NTC3+ (in), NTC4+ (in), PWM1 (bidir, see Microcontroller[1B]), PWM2 (bidir, see Microcontroller[1B]), SPI3_CS (bidir, see Microcontroller[3B]), SPI3_MISO (bidir, see Microcontroller[1C]), SPI3_MOSI (bidir, see Microcontroller[1C]), SPI3_SCLK (bidir, see Microcontroller[1C]), VBAT_CELL (in)

### Nets
+3V3: C39.2 C40.2 C41.2 C42.2 J8.1 Q3.1(G) Q6.1(G) Q7.1(G) R12.2 R18.2 R19.2 R28.2 R29.2 R30.2 R31.2 R39.2
+5V: CVCOM.2 R10.2 R17.2 R37.2 U5.5(VCOM) U5.20(SPIEN)
GND: C31.1 C32.1 C33.1 C34.1 C35.1 C36.1 C38.1 C43.1 C44.1 C45.1 C46.1 C47.1 C48.1 C49.1 C50.1 CESD1.2 CESD2.2 CESD3.2 CESD4.2 CESD5.2 CESD6.2 CESD7.2 CESD8.2 CESD9.2 CESD10.2 CESD11.2 CESD12.2 CESD13.2 CESD14.1 CESD15.2 CESD16.1 CESD17.2 CREG1.1 CVCOM.1 D7.A D8.2(A) J7.17 J7.18 J7.22 J7.24 J7.26 J7.28 MHOT.1(S) MHOT.2(S) MHOT.3(S) MHOT.5(D) MHOT.6(D) MHOT.7(D) MHOT.8(D) R21.2 R23.1 R23.2 R24.1 R26.1 R27.1 U5.6(CGND) U5.9(DGND) U5.22(AGND) U5.25(GNDREF) U5.65(GNDEP)
VREG: CREG1.2 J8.3 Q2.1(S) Q2.2(S) Q2.3(S) TPVREG.1 U5.18(VREG)
C0: CESD16.2 CESD17.1 FBSNS15.1 J7.16 RISENSE2.2 RSENSE.1 ; port C0, port ISENSEP
C1: CESD15.1 FBSNS14.1 J7.15 ; port C1
C2: CESD13.1 FBSNS13.1 J7.14 ; port C2
C3: CESD12.1 FBSNS12.1 J7.13 ; port C3
C4: CESD11.1 FBSNS11.1 J7.12 ; port C4
C5: CESD10.1 FBSNS10.1 J7.11 ; port C5
C6: CESD9.1 FBSNS9.1 J7.10 ; port C6
C7: CESD8.1 FBSNS8.1 J7.9 ; port C7
C8: CESD7.1 FBSNS7.1 J7.8 ; port C8
C9: CESD6.1 FBSNS6.1 J7.7 ; port C9
C10: CESD5.1 FBSNS5.1 J7.6 ; port C10
C11: CESD4.1 FBSNS4.1 J7.5 ; port C11
C12: CESD3.1 FBSNS3.1 J7.4 ; port C12
C13: CESD2.1 FBSNS2.1 J7.3 ; port C13
C14: CESD1.1 FBSNS1.1 J7.2 ; port C14
CAP1: C37.1 U5.64(CAP1)
CAP2: C37.2 U5.63(CAP2)
FAULTH_L9963: Q6.2(S) R17.1 R25.2
FAULTH_L_MCU: Q6.3(D) R18.1 ; port FAULTH_L_MCU
FAULTL_L9963: Q7.2(S) R27.2 R37.1 U5.11(GPIO2_FAULTL)
FAULTL_L_MCU: Q7.3(D) R39.1 ; port FAULTL_L_MCU
GPIO1_FAULTH: C38.2 D8.1(K) R25.1 R26.2 U5.10(GPIO1_FAULTH)
GPIO9_MISO: Q3.2(S) R10.1 U5.2(GPIO9_SDO)
ISENSEM: CESD14.2 J7.20 Q5.3(S) R49.1 RISENSE1.2 RSENSE.2 ; port ISENSEM
ISENSEM_IO: CISENSE_1.2 CISENSE_2.2 CISENSE_3.2 RISENSE1.1 U5.24(ISENSEm)
ISENSEP_IO: CISENSE_1.1 CISENSE_2.1 CISENSE_3.1 RISENSE2.1 U5.23(ISENSEp)
MHOT_GATE: C36.2 MHOT.4(G) R22.2
MHOT_VGS: J8.2 R22.1 R24.2
NPNDRV: C32.2 C33.2 C34.2 D7.K FB1.2 Q2.4(G) Q2.5-6-7-8(D) TPVBAT.1 U5.17(NPNDRV) U5.62(VBAT)  [also labelled VBAT_CELL_N]
NTC1+: C39.1 C46.2 C47.2 J7.21 R28.1 R32.2 ; port NTC1+
NTC1+_IO: R32.1 U5.12(GPIO3)
NTC2+: C40.1 C45.2 C50.2 J7.23 R30.1 R33.2 ; port NTC2+
NTC2+_IO: R33.1 U5.13(GPIO4)
NTC3+: C41.1 C44.2 C49.2 J7.25 R29.1 R34.2 ; port NTC3+
NTC3+_IO: R34.1 U5.14(GPIO5)
NTC4+: C42.1 C43.2 C48.2 J7.27 R31.1 R35.2 ; port NTC4+
NTC4+_IO: R35.1 U5.15(GPIO6)
NTC_INTERNAL_INPUT: C31.2 R20.1 U5.16(GPIO7_WAKEUP)
PWM1: Q5.1(G) R49.2 ; port PWM1
PWM2: Q4.1(G) R48.2 ; port PWM2
SPI3_CS: U5.4(ISOLm_NCS) ; port SPI3_CS
SPI3_MISO: Q3.3(D) R12.1 ; port SPI3_MISO
SPI3_MOSI: U5.3(ISOLp_SDI) ; port SPI3_MOSI
SPI3_SCLK: U5.1(GPIO8_SCK) ; port SPI3_SCLK
THERM_P: R19.1 R20.2 R21.1
VBAT_CELL_P: C35.2 FB1.1 J7.1 ; port VBAT_CELL
VBAT_MINUS: Q4.3(S) R48.1
NetCLPF1_1: CLPF1.1 CLPF2.2 RLPF2.2 U5.57(C13)
NetCLPF1_2: CLPF1.2 RLPF1.2 U5.61(C14)
NetCLPF2_1: CLPF2.1 CLPF3.2 RLPF3.2 U5.56(C12)
NetCLPF3_1: CLPF3.1 CLPF4.2 RLPF4.2 U5.52(C11)
NetCLPF4_1: CLPF4.1 CLPF5.2 RLPF5.2 U5.51(C10)
NetCLPF5_1: CLPF5.1 CLPF6.2 RLPF6.2 U5.47(C9)
NetCLPF6_1: CLPF6.1 CLPF7.2 RLPF7.2 U5.46(C8)
NetCLPF7_1: CLPF7.1 CLPF8.2 RLPF8.2 U5.42(C7)
NetCLPF8_1: CLPF8.1 CLPF9.2 RLPF9.2 U5.41(C6)
NetCLPF9_1: CLPF9.1 CLPF10.2 RLPF10.2 U5.37(C5)
NetCLPF10_1: CLPF10.1 CLPF11.2 RLPF11.2 U5.36(C4)
NetCLPF11_1: CLPF11.1 CLPF12.2 RLPF12.2 U5.32(C3)
NetCLPF12_1: CLPF12.1 CLPF13.2 RLPF13.2 U5.31(C2)
NetCLPF13_1: CLPF13.1 CLPF14.2 RLPF14.2 U5.27(C1)
NetCLPF14_1: CLPF14.1 RLPF15.2 U5.26(C0)
NetFBSNS1_2: FBSNS1.2 RDRV1.1 RLPF1.1 TPC14.1
NetFBSNS2_2: FBSNS2.2 RLPF2.1 TPC13.1 U5.59(B14_13)
NetFBSNS3_2: FBSNS3.2 RDRV2.1 RDRV3.1 RLPF3.1 TPC12.1
NetFBSNS4_2: FBSNS4.2 RLPF4.1 TPC11.1 U5.54(B12_11)
NetFBSNS5_2: FBSNS5.2 RDRV4.1 RDRV5.1 RLPF5.1 TPC10.1
NetFBSNS6_2: FBSNS6.2 RLPF6.1 TPC9.1 U5.49(B10_9)
NetFBSNS7_2: FBSNS7.2 RDRV6.1 RDRV7.1 RLPF7.1 TPC8.1
NetFBSNS8_2: FBSNS8.2 RLPF8.1 TPC7.1 U5.44(B8_7)
NetFBSNS9_2: FBSNS9.2 RDRV8.1 RDRV9.1 RLPF9.1 TPC6.1
NetFBSNS10_2: FBSNS10.2 RLPF10.1 TPC5.1 U5.39(B6_5)
NetFBSNS11_2: FBSNS11.2 RDRV10.1 RDRV11.1 RLPF11.1 TPC4.1
NetFBSNS12_2: FBSNS12.2 RLPF12.1 TPC3.1 U5.34(B4_3)
NetFBSNS13_2: FBSNS13.2 RDRV12.1 RDRV13.1 RLPF13.1 TPC2.1
NetFBSNS14_2: FBSNS14.2 RLPF14.1 TPC1.1 U5.29(B2_1)
NetFBSNS15_2: FBSNS15.2 RDRV14.1 RLPF15.1 TPC0.1
NetQ4_4: Q4.4(D) Q5.4(D)
NetRDRV1_2: RDRV1.2 U5.60(S14)
NetRDRV2_2: RDRV2.2 U5.58(S13)
NetRDRV3_2: RDRV3.2 U5.55(S12)
NetRDRV4_2: RDRV4.2 U5.53(S11)
NetRDRV5_2: RDRV5.2 U5.50(S10)
NetRDRV6_2: RDRV6.2 U5.48(S9)
NetRDRV7_2: RDRV7.2 U5.45(S8)
NetRDRV8_2: RDRV8.2 U5.43(S7)
NetRDRV9_2: RDRV9.2 U5.40(S6)
NetRDRV10_2: RDRV10.2 U5.38(S5)
NetRDRV11_2: RDRV11.2 U5.35(S4)
NetRDRV12_2: RDRV12.2 U5.33(S3)
NetRDRV13_2: RDRV13.2 U5.30(S2)
NetRDRV14_2: RDRV14.2 U5.28(S1)
NetU5_7: U5.7(ISOHp) U5.8(ISOHm)

Not connected (* = marked no-connect by the designer): J7 19*; U5 19(VTREF)* 21(VANA)*

### Notes on the sheet
- Battery Management System IC
- Battery Connector
- NTC Internal Circuit
- (near TPVBAT) Battery Filtering
- (near Q2) Safety Enhanced Driver
- Internal Cell Balancing
- hotplug protection
- 5V to 3V3 level shifter
- Is there enough speed for teh fault line to react? How should I set up the interrupt for the GPIO pins? Swap out this molex header and let MCU read thse fault signals with a  GPIO.
- Shouldn't I pass these fault lines into the microcontroller for processing? Instead of having a header?
- Fault Lines
- Neg Temp Coeff (NTC) Circuit
- Current Sense Circuit
- Inrush/Release Protection
- This test point is pretty huge? I'm unsure if they'll affect my layout stage? The current dev board uses a solder pad as a test point instead of these ones? Perhaps that'll be better? Takes less space?
- Battery Management System
- Max Lan
- v1

### Library data of the parts
C31 C47-C50 = 06035C682MAT2A: Multilayer Ceramic Capacitors MLCC - SMD/SMT KGM15AR71H682MT NEW GLOBAL PN 50V 6800pF A 581-KGM15AR71H682MT; Manufacturer: KYOCERA AVX; Rating: 6.8nF 50V X7R 0603; Manufacturer Part Number: 06035C682MAT2A; Distributor Link: https://www.mouser.tw/en/ProductDetail/KYOCERA-AVX/06035C682MAT2A?qs=Jt0XQ7CXnDG9m2YKP51QXw%3D%3D; Datasheet Link: https://datasheets.kyocera-avx.com/KGM_X7R.pdf; Dielectric: *
C32 C33 C39-C42 = MAJCH168BB7104KTEA01: as C14 on sheet Microcontroller; Manufacturer Part Number: MAJCH168BB7104KTEA01; Distributor Link: https://www.mouser.tw/en/ProductDetail/TAIYO-YUDEN/MAJCH168BB7104KTEA01?qs=ZcfC38r4PovaTBrG0IdezQ%3D%3D; Datasheet Link: https://www.mouser.com/catalog/specsheets/TAIYO_YUDEN_03-08-2024_MAJCH168BB7104KTEA01_SS.pdf?_gl=1*17qbpp1*_gcl_aw*R0NMLjE3ODUyMjg2NDkuQ2p3S0NBandwcUhUQmhBY0Vpd0FqMkFmdXJYOV9OUy1CV0xFSmd6T0FaYy1HZXR1bHVfaUZmaHVzRkI2bHhkODVUMjVSNlJWbnBOUkFob0NEdHNRQXZEX0J3RQ..*_gcl_au*MTM0NzYwMzc0Mi4xNzgyNDQ3MDMwLjE4MDQ0Nzg2ODUuMTc4NTI5MDg4OS4xNzg1MjkxOTE2LjE1NDk0Mzk5MTcuMTc4NTIxODYwOC4xNzg1MjkxOTE2*_ga*MTg5NTU5OTIyLjE3ODI0NDcwMzM.*_ga_15W4STQT4T*czE3ODUyODM3NTgkbzk5JGcxJHQxNzg1MjkxOTI1JGo0MiRsMCRoMA..; Dielectric: *
C34 CVCOM = C1210C225J1RACAUTO: Multilayer Ceramic Capacitors MLCC - SMD/SMT 100V 2.2uF X7R 1210 5% AEC-Q200; Manufacturer: KEMET; Rating: 2.2uF 100V X7R 1210 5%; Manufacturer Part Number: C1210C225J1RACAUTO; Distributor Link: https://www.mouser.tw/en/ProductDetail/KEMET/C1210C225J1RACAUTO?qs=sGAEpiMZZMvsSlwiRhF8qtbmv%2FbKa1yYzrRuCBjX9aFrg%252BEkfh5A0g%3D%3D; Datasheet Link: https://www.mouser.tw/datasheet/3/508/1/KEM_C1023_X7R_AUTO_SMD.pdf; Dielectric: *
C35 CESD1-CESD17 = C0603C473J1RACTU: as C11 on sheet Microcontroller; Manufacturer Part Number: C0603C473J1RACTU; Distributor Link: https://www.mouser.tw/en/ProductDetail/KEMET/C0603C473J1RACTU?qs=sGAEpiMZZMvsSlwiRhF8qpRMYGxmftL79YZ310PzB5U%3D; Datasheet Link: https://www.mouser.tw/datasheet/3/72/1/C0603C473J1RACTU.pdf; Dielectric: *
C36 = CGA3E2X7R2A472K080AA: Multilayer Ceramic Capacitors MLCC - SMD/SMT CGA 0603 100V 4700pF X7R 10% AEC-Q200; Manufacturer: TDK; Rating: 4.7nF 100V 10% X7R 0603; Manufacturer Part Number: CGA3E2X7R2A472K080AA; Distributor Link: https://www.mouser.tw/en/ProductDetail/TDK/CGA3E2X7R2A472K080AA?qs=NRhsANhppD8QTPocwjf0SQ%3D%3D; Datasheet Link: https://product.tdk.com/system/files/dam/doc/product/capacitor/ceramic/mlcc/catalog/mlcc_automotive_midvoltage_en.pdf?ref_disty=mouser; Dielectric: *
C37 = C1608X7R2A105K080AC: MLCC - SMD/SMT Commercial Grade,MLCC,0603,X7R,100V,1uF,+/-10%,0.8mm; Manufacturer Name: TDK; ComponentLink1Description: Datasheet Link 1; ComponentLink1URL: https://product.tdk.com/system/files/dam/doc/product/capacitor/ceramic/mlcc/catalog/mlcc_commercial_general_en.pdf; Distributor Name: Mouser; ComponentLink2Description: Distributor Link 1; ComponentLink2URL: https://www.mouser.tw/zh/ProductDetail/TDK/C1608X7R2A105K080AC?qs=efUn273yAhc5BfjaNflQJg%3D%3D; Value: 0603,X7R,100V,1uF,
C38 C43-C46 = KAM15AR71H222KT: Multilayer Ceramic Capacitors MLCC - SMD/SMT 50V 2200pF X7R 0603 10% AEC-Q200; Manufacturer: KYOCERA AVX; Rating: 2.2nF 50V X7R 0603 10%; Manufacturer Part Number: KAM15AR71H222KT; Distributor Link: https://www.mouser.tw/en/ProductDetail/KYOCERA-AVX/KAM15AR71H222KT?qs=OcgtsXO%252B3gvpJlkWsZMdBg%3D%3D; Datasheet LInk: https://ele.kyocera.com/assets/products/capacitor/KGM_Series_e.pdf; Dielectric: *
CISENSE_1 = GRM188Z71A106KA73D: Multilayer Ceramic Capacitors MLCC - SMD/SMT 10 uF 10 VDC 10% 0603 X7R; Manufacturer: Murata Electronics; Rating: 10uF 10V X7R 0603 10%; Manufacturer Part Number: GRM188Z71A106KA73D; Distributor Link: https://www.mouser.tw/en/ProductDetail/Murata-Electronics/GRM188Z71A106KA73D?qs=sGAEpiMZZMvsSlwiRhF8qtsGU%2FCnaNeQz1Jv5GwJ1ahYh1H97x5nNw%3D%3D; Datasheet Link: https://www.mouser.tw/datasheet/3/76/2/GRM188Z71A106KA73_01A.pdf; Dielectric: *
CISENSE_2 = VJ0603Y683JXQCW1BC: Multilayer Ceramic Capacitors MLCC - SMD/SMT 0603 0.068uF 10volts X7R 5%; Manufacturer: Vishay/Vitramon; Rating: 68nF 10V X7R 0603 5%; Manufacturer Part Number: VJ0603Y683JXQCW1BC; Distributor Link: https://www.mouser.tw/en/ProductDetail/Vishay-Vitramon/VJ0603Y683JXQCW1BC?qs=sGAEpiMZZMvsSlwiRhF8qsy6D4RIz3svadoEWL3SLRA%3D; Datasheet Link: https://www.vishay.com/doc?28548; Dielectric: *
CISENSE_3 = KGM05AR71A330KH: Multilayer Ceramic Capacitors MLCC - SMD/SMT 10V 33pF X7R 0402 10%; Manufacturer: KYOCERA AVX; Rating: 33pF 10V X7R 0402 10%; Manufacturer Part Number: KGM05AR71A330KH; Distributor Link: https://www.mouser.tw/en/ProductDetail/KYOCERA-AVX/KGM05AR71A330KH?qs=sGAEpiMZZMvsSlwiRhF8qrQG6leidpLjKweERFFvD5%2FTA98x%2FHGWTg%3D%3D; Datasheet Link: https://ele.kyocera.com/assets/products/capacitor/KGM_Series_e.pdf; Dielectric: *
CLPF1-CLPF14 = KAF15AR71H103JM: Multilayer Ceramic Capacitors MLCC - SMD/SMT Automotive MLCC 0603, 10nF, 5%, X7R, 50VDC; Manufacturer: KYOCERA AVX; Rating: 10nF 50V X7R 0603 5%; Manufacturer Part Number: KAF15AR71H103JM; Distributor Link: https://www.mouser.tw/en/ProductDetail/KYOCERA-AVX/KAF15AR71H103JM?qs=sGAEpiMZZMvsSlwiRhF8qrQG6leidpLjNf3RmkJWfl3qRaUgdYaoYg%3D%3D; Datasheet Link: https://www.mouser.tw/datasheet/3/5926/1/AutoMLCCKAF.pdf; Dielectric: *
CREG1 = C0805C475J4RACAUTO7210: Multilayer Ceramic Capacitors MLCC - SMD/SMT 16 V 4.7 uF 0805 X7R 5 % AECQ200; Manufacturer: KEMET; Rating: 4.7uF 16V X7R 0805 5%; Manufacturer Part Number: C0805C475J4RACAUTO7210; Distributor Link: https://www.mouser.tw/en/ProductDetail/KEMET/C0805C475J4RACAUTO7210?qs=sGAEpiMZZMsh%252B1woXyUXj8cbwg7mY%252Bp%2F256b4GbLr%252BU%3D; Datasheet Link: https://www.mouser.tw/datasheet/3/508/1/KEM_C1023_X7R_AUTO_SMD.pdf; Dielectric: *
D7 = 5.0SMDJ60A: ESD 保護二極體 / TVS 二極體 60V 5KW 5% UNI DO-214AB (SMC); Manufacturer Name: Bourns; ComponentLink1Description: Datasheet Link; ComponentLink1URL: https://www.mouser.tw/datasheet/3/40/1/5_0smdj.pdf
D8 = CMP-1060-00696-1: Zener Voltage Regulator, 300 mW, 2-Pin SOD-323, Pb-Free, Tape and Reel; Manufacturer: On Semiconductor; VZ Typ (V): 4.7; P Max (W): 0.3; ComponentLink3URL: http://www.onsemi.com/pub_link/Collateral/477-02.PDF.1; ComponentLink3Description: Package Specification; ComponentLink2Description: Datasheet; DatasheetVersion: Rev. 9; RoHS: Pb-Free; PartNumber: SZMM3Z4V7T1G; ComponentLink2URL: http://www.onsemi.cn/pub_link/Collateral/MM3Z2V4T1-D.PDF; Packing: Tape and Reel; ComponentLink1URL: http://www.onsemi.com/; ComponentLink1Description: Manufacturer URL; Mounting Technology: Surface Mount; PackageVersion: Rev. H, 03/2007; PackageDescription: 2-Pin SOD, Body 1.7 x 1.25 mm; PackageReference: SOD-323-2-477-02
FB1 = CMP-08257-000025-1: FERRITE BEAD 1 KOHM 0805 1LN; Tolerance: 25%; Number of Lines: 1; DC Resistance (DCR): 150mR; Impedance: 1kR; Case Code (Metric): 2012; Mount: Surface Mount; Case/Package: 0805; Case Code (Imperial): 0805; Max Current Rating: 1.5A; Height: 0.041inch; Max DC Current: 1.5A; Min Operating Temperature: -55°C; Length: 0.079inch; Width: 1.25mm; Ratings: AEC-Q200; Packaging: Tape and Reel; RoHS Compliant: Yes; Termination: SMD/SMT; Test Frequency: 100MHz; Package Quantity: 4000; Weight: 0.000194oz; Max Operating Temperature: 125°C; Lead Free: Lead Free
FBSNS1-FBSNS15 = CMP-08257-000025-1: FERRITE BEAD 1 KOHM 0805 1LN; Max Current Rating: 1.5A; Tolerance: 25%; Number of Lines: 1; DC Resistance (DCR): 150mR; Impedance: 1kR; Case Code (Metric): 2012; Mount: Surface Mount; Case/Package: 0805; Case Code (Imperial): 0805; Height: 0.041inch; Max DC Current: 1.5A; Min Operating Temperature: -55°C; Length: 0.079inch; Width: 1.25mm; Ratings: AEC-Q200; Packaging: Tape and Reel; RoHS Compliant: Yes; Termination: SMD/SMT; Test Frequency: 100MHz; Package Quantity: 4000; Weight: 0.000194oz; Max Operating Temperature: 125°C; Lead Free: Lead Free
J7 = CMP-04776-000733-1: IGRID PLUG TH HDR RA GF 28CKT
J8 = CMP-02766-001695-1: CONN HEADER VERT 3POS 2MM; Gender: Male; Number of Positions: 3; Max Current Rating: 3.9A; Max Voltage Rating (AC): 500V; Packaging: Bulk; RoHS Compliant: Yes; Mount: Through Hole; Length: 6mm; Contact Type: Male Pin; Package Quantity: 1; Depth: 1.97mm; Contact Material: Bronze; Insulation Material: Polymer; Series: TMM; Contact Plating: Tin; Fastening Type: Pull; Housing Color: Black; Pitch: 2mm; Termination: Solder; Contact Mating Length: 0.157inch; Min Operating Temperature: -55°C; REACH SVHC: No SVHC; Orientation: Straight; Number of Rows: 1; Color: Black; Insulation Color: Black; Connector Type: Header; Radiation Hardening: No; Number of Contacts: 3; Lead Free: Lead Free; Contact Finish - Mating: TIN; Max Operating Temperature: 105°C; Housing Material: Polymer; Contact Shape: Square
MHOT = STS8N6LF6AG: Automotive-grade N-channel 60 V, 21 mΩ typ., 8 A STripFET F6 / Power MOSFET in an SO-8 package; Manufacturer Name: STMicroelectronics; Ratings: 60 V, 21 mOhm typ., 8 A; ComponentLink1Description: Datasheet Link; ComponentLink1URL: https://www.st.com/resource/en/datasheet/sts8n6lf6ag.pdf; ComponentLink2Description: Distributor Link; ComponentLink2URL: https://www.mouser.tw/en/ProductDetail/STMicroelectronics/STS8N6LF6AG?qs=Mv7BduZupUjwgFHuxl15FA%3D%3D; Distributor Name: Mouser
Q2 = CMP-12198-000012-1: MOSFET N CH 100V 20A PWRFLT5X6; Manufacturer: STMicroelectronics; Number Of N Channels: 1; Max Forward Diode Voltage: 1.3V; Turn On Delay Time: 8.7ns; Power Dissipation: 70W; Input Capacitace At Vds: 970pF @ 25V; Depletion Mode: False; Drain To Source Resistance: 25mΩ; Gate Charge At Vgs: 20.5nC @ 10V; Threshold Vgs Min: 1V; Max Junction Temp: +175°C; Reverse Recovery Time: 42.5ns; Standoff Height: 0.02mm; Reverse Recovery Charge: 87nC; Automotive Grade: Grade 0; Pulse Drain Current: 31.2A; Gate To Source Voltage: 20V; Turn Off Delay Time: 50.6ns; Threshold Vgs Max: 3V; Octopart: https://octopart.com/stl8n10lf3-stmicroelectronics-28565037; Automotive: Yes; Drain To Source Breakdown Voltage: 100V; Temperature Range Low: -55°C; Manufacturer Part Number: STL8N10LF3; Digikey Description: MOSFET N CH 100V 20A PWRFLT5X6; Device Class L1: Discrete Semiconductors; Mouser Description: Trans MOSFET N-CH 100V 20A Automotive 8-Pin Power Flat T/R; Temperature Range High: +175°C; ComponentLink2Description: Datasheet; Device Class L3: MOSFETs; Height: 1mm; Drain To Source Voltage: 100V; Device Class L2: Transistors; RoHS: TRUE; Number Of Channels: 1; Category: Trans; Temperature: -55°C to +175°C; ComponentLink2URL: https://www.st.com/resource/en/datasheet/stl8n10lf3.pdf; Lead Free: Yes; Continuous Drain Current: 20A; Package: PowerFLAT5x6-A0Y5_8231817_R_WF
Q3 Q6 Q7 = CMP-02550-000327-1: MOSFET N-CH 30V 3.16A SOT23-3
Q4 Q5 = CMP-00278-84329156-1: HUF76629D3ST N-Channel Logic Level UltraFET® Power MOSFET 100V, 20A, 52mΩ; Manufacturer Lifecycle Status: ACTIVE; Fall Time: 60ns; Number of Elements: 1; Power Dissipation: 110W; Gate to Source Voltage (Vgs): 16V; Element Configuration: Single; Input Capacitance: 1.285nF; Turn-On Delay Time: 6.8ns; Resistance: 54mΩ; Drain to Source Resistance: 41.5mΩ; Turn-Off Delay Time: 67ns; Rise Time: 28ns; Voltage Rating (DC): 100V; Drain to Source Voltage (Vdss): 100V; NexarPartId: 84329156; Mount: Surface Mount; Continuous Drain Current (ID): 20A; Current Rating: 20A; Drain to Source Breakdown Voltage: 100V; Weight: 260.37mg; Case/Package: TO-252-3; RoHS: Compliant; Rds On Max: 52mΩ; Max Power Dissipation: 110W; Min Operating Temperature: -55°C; Number of Pins: 3; Schedule B: 8541290080, 8541290080; Lead Free: Lead Free; Radiation Hardening: No; Lifecycle Status: Production; Max Operating Temperature: 175°C
R10 R12 R17-R19 R27-R31 R37 R39 R48 R49 = CRCW060310K0FKEI: as R11 on sheet Microcontroller; Manufacturer Part Number: CRCW060310K0FKEI; Distributor Link: https://www.vishay.com/docs/20035/dcrcwe3.pdf
R20 = CRCW08053K90FHTAP: Thick Film Resistors - SMD CRCW0805-P 3.9K 1% 50 RT1; Manufacturer: Vishay; Values: 3.9kohm 1% 0805 1/4W; Manufacturer Part Number: CRCW08053K90FHTAP; Distributor Link: https://www.mouser.tw/en/ProductDetail/Vishay/CRCW08053K90FHTAP?qs=Zz7%252BYVVL6bH%252BbAN5zIsieQ%3D%3D; Datasheet Link: https://www.vishay.com/docs/20035/dcrcwe3.pdf
R21 = NTCG163JH103HTDS: NTC Thermistors 0603 10Kohm 3% Thermistor AEC-Q200; Manufacturer Name: TDK; Values: 0603 10Kohm 3%; ComponentLink1Description: Distributor Link; ComponentLink1URL: https://www.mouser.tw/en/ProductDetail/TDK/NTCG163JH103HTDS?qs=5aG0NVq1C4zM%252BOwXBgXJzA%3D%3D; ComponentLink2Description: Datasheet Link; ComponentLink2URL: https://product.tdk.com/system/files/dam/doc/product/sensor/ntc/chip-ntc-thermistor/catalog/tpd_automotive_ntc-thermistor_ntcg_en.pdf?ref_disty=mouser
R22 = AC0603JR-071KL: Thick Film Resistors - SMD 1 kOhms 1/10 W 75 V 5% 0603 100 PPM / C - 55 C / + 155 C AEC-Q200; Manufacturer: YAGEO; Values: 1k 1/10W 5% 0603; Manufacturer Part Number: AC0603JR-071KL; Distributor Link: https://www.mouser.tw/en/ProductDetail/YAGEO/AC0603JR-071KL?qs=ygRr%2FtkhtetUuJMpTs3DCw%3D%3D; Datasheet Link: https://www.mouser.tw/datasheet/3/508/1/PYU_AC_51_ROHS_L.pdf
R23 = ERJ-U1TF47R0U: Thick Film Resistors - SMD 2512 1% 47ohm Anti-Sulfur AEC-Q200; Manufacturer: Panasonic; Values: 47ohm 1W 1% 2512; Manufacturer Part Number: ERJ-U1TF47R0U; Distributor Link: https://www.mouser.tw/en/ProductDetail/Panasonic/ERJ-U1TF47R0U?qs=pdFhdcvjjgisFXwKlPwjTg%3D%3D; Datasheet Link: https://industrial.panasonic.com/cdbs/www-data/pdf/RDO0000/RDO0000C334.pdf
R24 = RN73H1ETTP1003F50: Thin Film Resistors - SMD 100kOhm,0402,1%,50pp m,63mW,50V; Manufacturer: KOA Speer; Value: 100kohm 63mW 1% 50V 0402; Manufacturer Part Number: RN73H1ETTP1003F50; Distributor Link: https://www.mouser.tw/en/ProductDetail/KOA-Speer/RN73H1ETTP1003F50?qs=9tvNVxbbcErNimAbsV8w2A%3D%3D; Datasheet Link: https://www.mouser.com/catalog/specsheets/KOA_Speer_RN73H_8_21_24.pdf?_gl=1*o8km1j*_gcl_aw*R0NMLjE3ODUzMTQwMDguQ2p3S0NBand5YWJUQmhCRkVpd0FNM21OVUYxUXVUb0ZwX2dLajRxZHZDX2pVX0QwRUdOSWZ2RU5FN2JEQzdDSW5XclEtUVZ2eEpXemdSb0NLeGtRQXZEX0J3RQ..*_gcl_au*MTM0NzYwMzc0Mi4xNzgyNDQ3MDMwLjE1Njk2ODIzNTUuMTc4NTM4MDQ3My4xNzg1MzgxNDMxLjEzOTYzOTEyODMuMTc4NTMxNDU2Ny4xNzg1MzgxNDMx*_ga*MTg5NTU5OTIyLjE3ODI0NDcwMzM.*_ga_15W4STQT4T*czE3ODUzNzgxMTYkbzEwNCRnMSR0MTc4NTM4MTQzNyRqNTQkbDAkaDA.
R25 = AC0603JR-076K2L: Thick Film Resistors - SMD 6.2 kOhms 1/10 W 75 V 5% 0603 100 PPM / C - 55 C / + 155 C AEC-Q200; Manufacturer: YAGEO; Value: 6.2kohm 1/10W 5% 0603; Manufacturer Part Number: AC0603JR-076K2L; Distributor Link: https://www.mouser.tw/en/ProductDetail/YAGEO/AC0603JR-076K2L?qs=sGAEpiMZZMvdGkrng054twVr7TWeaA0stvTf8PmxIcM%3D; Datasheet Link: https://www.mouser.tw/datasheet/3/508/1/PYU_AC_51_ROHS_L.pdf
R26 = RC0603FR-1018KL: Thick Film Resistors - SMD General Purpose Chip Resistor 0603, 18kOhms, 1%, 1/10W; Manufacturer: YAGEO; Values: 18kohm 1% 1/10W 0603; Manufacturer Part Number: RC0603FR-1018KL; Distributor Link: https://www.mouser.tw/en/ProductDetail/YAGEO/RC0603FR-1018KL?qs=qpJ%252B%252B%252Bdg6p1T2VMMxU7GeA%3D%3D
R32-R35 = 35021K5FT: Thick Film Resistors - SMD 3502 1K5 1%; Manufacturer: TE Connectivity; Values: 1.5k 2W 1% 2010; Manufacturer Part Number: 35021K5FT; Distributor Link: https://www.mouser.tw/en/ProductDetail/TE-Connectivity-Holsworthy/35021K5FT?qs=gZXFycFWdAP5xURCJH31VQ%3D%3D; Datasheet Link: https://www.te.com/commerce/DocumentDelivery/DDEController?Action=showdoc&DocId=Data%20Sheet%7F1773204-4%7FA%7Fpdf%7FEnglish%7FENG_DS_1773204-4_A.pdf%7F2176397-76
RDRV1-RDRV14 = CRCW060339R0FKEAHP: Thick Film Resistors - SMD 0.75W 39ohms 1% High Power AEC-Q200; Manufacturer: Vishay; Values: 39ohm 3/4W 1% 0603; Manufacturer Part Number: CRCW060339R0FKEAHP; Distributor Link: https://www.mouser.tw/en/ProductDetail/Vishay/CRCW060339R0FKEAHP?qs=YmE2lSBYOPkz7Ks0zEhjEg%3D%3D; Datasheet Link: https://www.vishay.com/docs/20115/crcwhp.pdf
RISENSE1 RISENSE2 = CRM2010-FX-1000ELF: Current Sense Resistors - SMD CHIP RESISTOR Low Value 100ohm 1W 1% 2010 Thick Film Resistor; Manufacturer: Bourns; Manufacturer Part Number: CRM2010-FX-1000ELF; Distributor Link: https://www.mouser.tw/en/ProductDetail/Bourns/CRM2010-FX-1000ELF?qs=fgHA1UgJI8Bqg2%2Fam14ESQ%3D%3D; Datasheet Link: https://www.mouser.tw/datasheet/3/40/1/crm0805_1206_2010.pdf; Values: 100ohm 1W 1% 2010
RLPF1-RLPF15 = CRCW0603100RJNEBC: Thick Film Resistors - SMD 1/10Watt 100ohms 5% 0603 Commercial Use; Manufacturer: Vishay; Values: 100ohm 1/10W 5% 0603; Manufacturer Part Number: CRCW0603100RJNEBC; Distributor Link: https://www.mouser.tw/en/ProductDetail/YAGEO/RT0603WRE07100RL?qs=sGAEpiMZZMtlubZbdhIBIKm0gsRX2fVkkBVJnMJ1ydc%3D; Datasheet Link: https://www.vishay.com/docs/20035/dcrcwe3.pdf
RSENSE = WSLP5931L1000FEA: Current Sense Resistors - SMD 0.0001 ohm 1%; Manufacturer: Vishay/Dale; Values: 100uohm 15W 1% 5931; Manufacturer Part Number: WSLP5931L1000FEA; Distributor Link: https://www.mouser.tw/en/ProductDetail/Vishay-Dale/WSLP5931L1000FEA?qs=AQlKX63v8Rs%252BJpQIynINvA%3D%3D; Datasheet Link: https://www.vishay.com/doc?30176
TPC0-TPC14 TPVBAT TPVREG = CMP-1672-00006-4: Test Point, Yellow, Through Hole, RoHS, Bulk; Manufacturer: Keystone; PackageDescription: 1-Pin Through Hole Device, Dia 3.17 mm; REACH SVHC: No SVHC; ComponentLink2Description: Datasheet; ComponentLink2URL: http://www.keyelco.com/product-pdf.cfm?p=1323; Package Quantity: 100; Colour: Yellow; Height: 8.12 mm; RoHSCompliant: true; Contact Material: Bronze; Mount: Through Hole; Contact Plating: Silver; ComponentLink1URL: http://www.keyelco.com/; Packaging: Bulk; Mounting Technology: Through Hole; PackageReference: 5014; ComponentLink1Description: Manufacturer URL; DatasheetVersion: Rev. F, 12/2013
U5 = L9963E-TR: Battery Management Automotive chip for battery management applications with daisy chain up to 31 de; Manufacturer Name: STMicroelectronics; Distributor Name: Mouser; ComponentLink1Description: Datasheet Link; ComponentLink1URL: https://www.st.com/resource/en/datasheet/l9963e.pdf

## Sheet Power_Management.SchDoc
size A4; SheetNumber: 3; SheetTotal: 4
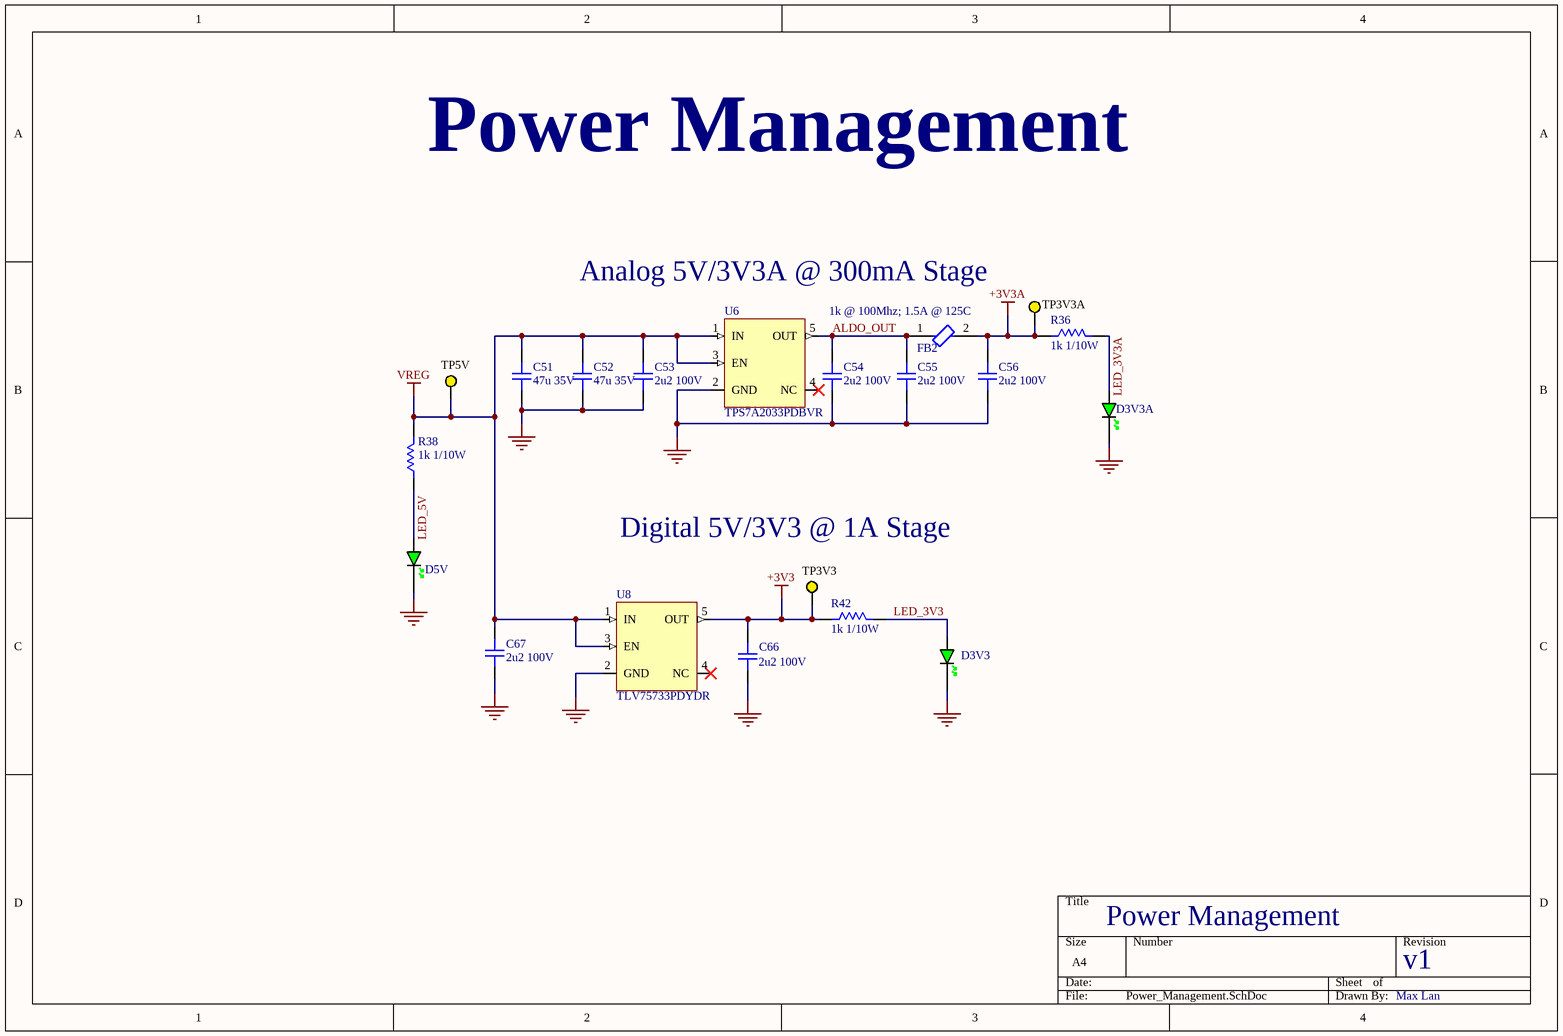
[diagram p4: Power_Management.SchDoc]

### Parts
C51  47u 35V  [CAP_2220]
C52  47u 35V  [CAP_2220]
C53  2u2 100V  [CAP_1210]
C54  2u2 100V  [CAP_1210]
C55  2u2 100V  [CAP_1210]
C56  2u2 100V  [CAP_1210]
C66  2u2 100V  [CAP_1210]
C67  2u2 100V  [CAP_1210]
D3V3  GREEN  [LED_0603_GREEN]  (value not drawn)
D3V3A  GREEN  [LED_0603_GREEN]  (value not drawn)
D5V  GREEN  [LED_0603_GREEN]  (value not drawn)
FB2  1k @ 100Mhz; 1.5A @ 125C  [FP-MPZ2012-MFG]
R36  1k 1/10W  [RES_0603]
R38  1k 1/10W  [RES_0603]
R42  1k 1/10W  [RES_0603]
TP3V3  5014  [KSTN-5014_V]  (value not drawn)
TP3V3A  5014  [KSTN-5014_V]  (value not drawn)
TP5V  5014  [KSTN-5014_V]  (value not drawn)
U6  TPS7A2033PDBVR  [TPS7A2033PDBVR]
U8  TLV75733PDYDR  [TLV75733PDYDR]

### Nets
+3V3: C66.2 R42.1 TP3V3.1 U8.5(OUT)
+3V3A: C56.2 FB2.2 R36.1 TP3V3A.1
GND: C51.1 C52.1 C53.1 C54.1 C55.1 C56.1 C66.1 C67.1 D3V3.K D3V3A.K D5V.K U6.2(GND) U8.2(GND)
VREG: C51.2 C52.2 C53.2 C67.2 R38.1 TP5V.1 U6.1(IN) U6.3(EN) U8.1(IN) U8.3(EN)
ALDO_OUT: C54.2 C55.2 FB2.1 U6.5(OUT)
LED_3V3: D3V3.A R42.2
LED_3V3A: D3V3A.A R36.2
LED_5V: D5V.A R38.2

Not connected (* = marked no-connect by the designer): U6 4(NC)*; U8 4(NC)*

### Notes on the sheet
- Power Management
- Analog 5V/3V3A @ 300mA Stage
- Digital 5V/3V3 @ 1A Stage
- v1
- Max Lan

### Library data of the parts
C51 C52 = C5750X7R1V476M230KC: MLCC - SMD/SMT 2220 35VDC 47uF 20% X7R; Manufactuer Name: TDK; ComponentLink1Description: Datasheet Link; ComponentLink1URL: https://product.tdk.com/system/files/dam/doc/product/capacitor/ceramic/mlcc/catalog/mlcc_commercial_highvoltage_en.pdf; Distributor Name: Mouser; ComponentLink2Description: Distributor Link; ComponentLink2URL: https://www.mouser.tw/zh/ProductDetail/TDK/C5750X7R1V476M230KC?qs=rSMjJ%252B1ewcSIfs95ZgB3Sw%3D%3D
C53-C56 C66 C67 = C1210C225J1RACAUTO: as C34 on sheet L9963E_BMS_IC; Manufacturer Part Number: C1210C225J1RACAUTO; Distributor Link: https://www.mouser.tw/en/ProductDetail/KEMET/C1210C225J1RACAUTO?qs=sGAEpiMZZMvsSlwiRhF8qtbmv%2FbKa1yYzrRuCBjX9aFrg%252BEkfh5A0g%3D%3D; Datasheet Link: https://www.mouser.tw/datasheet/3/508/1/KEM_C1023_X7R_AUTO_SMD.pdf; Dielectric: *
D3V3 D3V3A D5V = LED_0603_GREEN: LED 0603 GREEN SMD
FB2 = CMP-08257-000025-1: as FB1 on sheet L9963E_BMS_IC; Case Code (Metric): 2012; Mount: Surface Mount; Case/Package: 0805; Case Code (Imperial): 0805; Max Current Rating: 1.5A; Height: 0.041inch; Max DC Current: 1.5A; Min Operating Temperature: -55°C; Length: 0.079inch; Width: 1.25mm; Ratings: AEC-Q200; Packaging: Tape and Reel; RoHS Compliant: Yes; Termination: SMD/SMT; Test Frequency: 100MHz; Package Quantity: 4000; Weight: 0.000194oz; Max Operating Temperature: 125°C; Lead Free: Lead Free
R36 R38 R42 = CR0603-FX-1001EPF: as R13 on sheet Microcontroller; Manufacturer Part Number: CR0603-FX-1001EPF; Distributor Link: https://www.mouser.tw/en/ProductDetail/Bourns/CR0603-FX-1001EPF?qs=sGAEpiMZZMvdGkrng054t2cqbZCzJY7NyLPI0qsjVVoXr8t57oNyzw%3D%3D; Datasheet Link: https://www.mouser.tw/datasheet/3/40/1/CR-PF.pdf
TP3V3 TP3V3A TP5V = CMP-1672-00006-4: as TPC0 on sheet L9963E_BMS_IC; PackageDescription: 1-Pin Through Hole Device, Dia 3.17 mm; REACH SVHC: No SVHC; ComponentLink2Description: Datasheet; ComponentLink2URL: http://www.keyelco.com/product-pdf.cfm?p=1323; Package Quantity: 100; Colour: Yellow; Height: 8.12 mm; RoHSCompliant: true; Contact Material: Bronze; Mount: Through Hole; Contact Plating: Silver; ComponentLink1URL: http://www.keyelco.com/; Packaging: Bulk; Mounting Technology: Through Hole; PackageReference: 5014; ComponentLink1Description: Manufacturer URL; DatasheetVersion: Rev. F, 12/2013
U6 = TPS7A2033PDBVR: LDO Voltage Regulators 300-mA ultra-low-noi se low-IQ low-dropo / 300mA, Ultra-Low-Noise, Low-IQ, High PSRR LDO; Manufacturer Name: Texas Instruments; Ratings: 300mA  Input voltage range: 1.6V to 6.0V Output voltage range: 0.8V to 5.5V; Manufacturer Part Number: TPS7A2033PDBVR; ComponentLink1Description: Datasheet Link; ComponentLink1URL: https://www.ti.com/lit/gpn/tps7a20; ComponentLink2Description: Manufacturer Link; ComponentLink2URL: https://www.mouser.tw/en/ProductDetail/Texas-Instruments/TPS7A2033PDBVR?qs=hd1VzrDQEGjk%2FOBnRfKB4A%3D%3D&utm_id=22416807323&utm_source=google&utm_medium=cpc&utm_marketing_tactic=apaccorp&gad_source=1&gad_campaignid=22410328932&gbraid=0AAAAADn_wf1iU6pLOROSll7N1bOE2OfPs&gclid=CjwKCAjwj7HTBhBiEiwA8s35OiejKBh_upysW4k-S-XykRFXSFhPMWyPmweCSWJvNlSOyNgoqC3kFBoCQT8QAvD_BwE
U8 = TLV75733PDYDR: LDO Voltage Regulators 1-A low-IQ high-acc uracy low-dropout (L / Low dropout: / – 425mV (maximum) at 1A (3.3VOUT) / • Input voltage range: 1.45V to 5.5V; Manufacturer Name: Texas Instruments; ComponentLink1Description: Distributor Link; ComponentLink1URL: https://www.mouser.tw/en/ProductDetail/Texas-Instruments/TLV75733PDYDR?qs=ZcfC38r4PovvOY4HwNOrpQ%3D%3D; ComponentLink2Description: Datasheet Link; ComponentLink2URL: https://www.ti.com/lit/gpn/tlv757p; Ratings: Input voltage range: 1.45V to 5.5V

## Sheet TopLevel.SchDoc
size A4; SheetNumber: 4; SheetTotal: 4
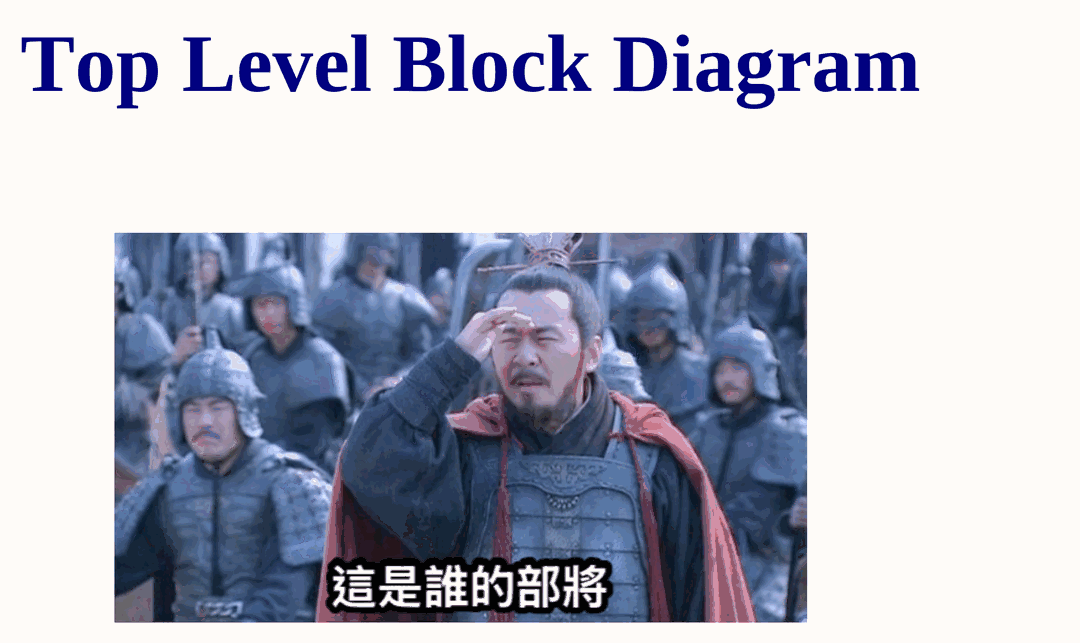
[diagram p5: TopLevel.SchDoc]

### Notes on the sheet
- Top Level Block Diagram